# EasyEDA Pro project ProPrj_Inverted_MAML_6x6_2026-07-03.epro

# Schematic MUL_CELL_2X_2T1C_1
Create Date: 2026-06-07; Page Name: P1; Project Name: Inverted_MAML_6x6; Schematic Name: Schematic2; Update Date: 2026-06-07; Company: EasyEDA.com; Drawn: Olle Welin; Page Size: A4; Version: V1.0
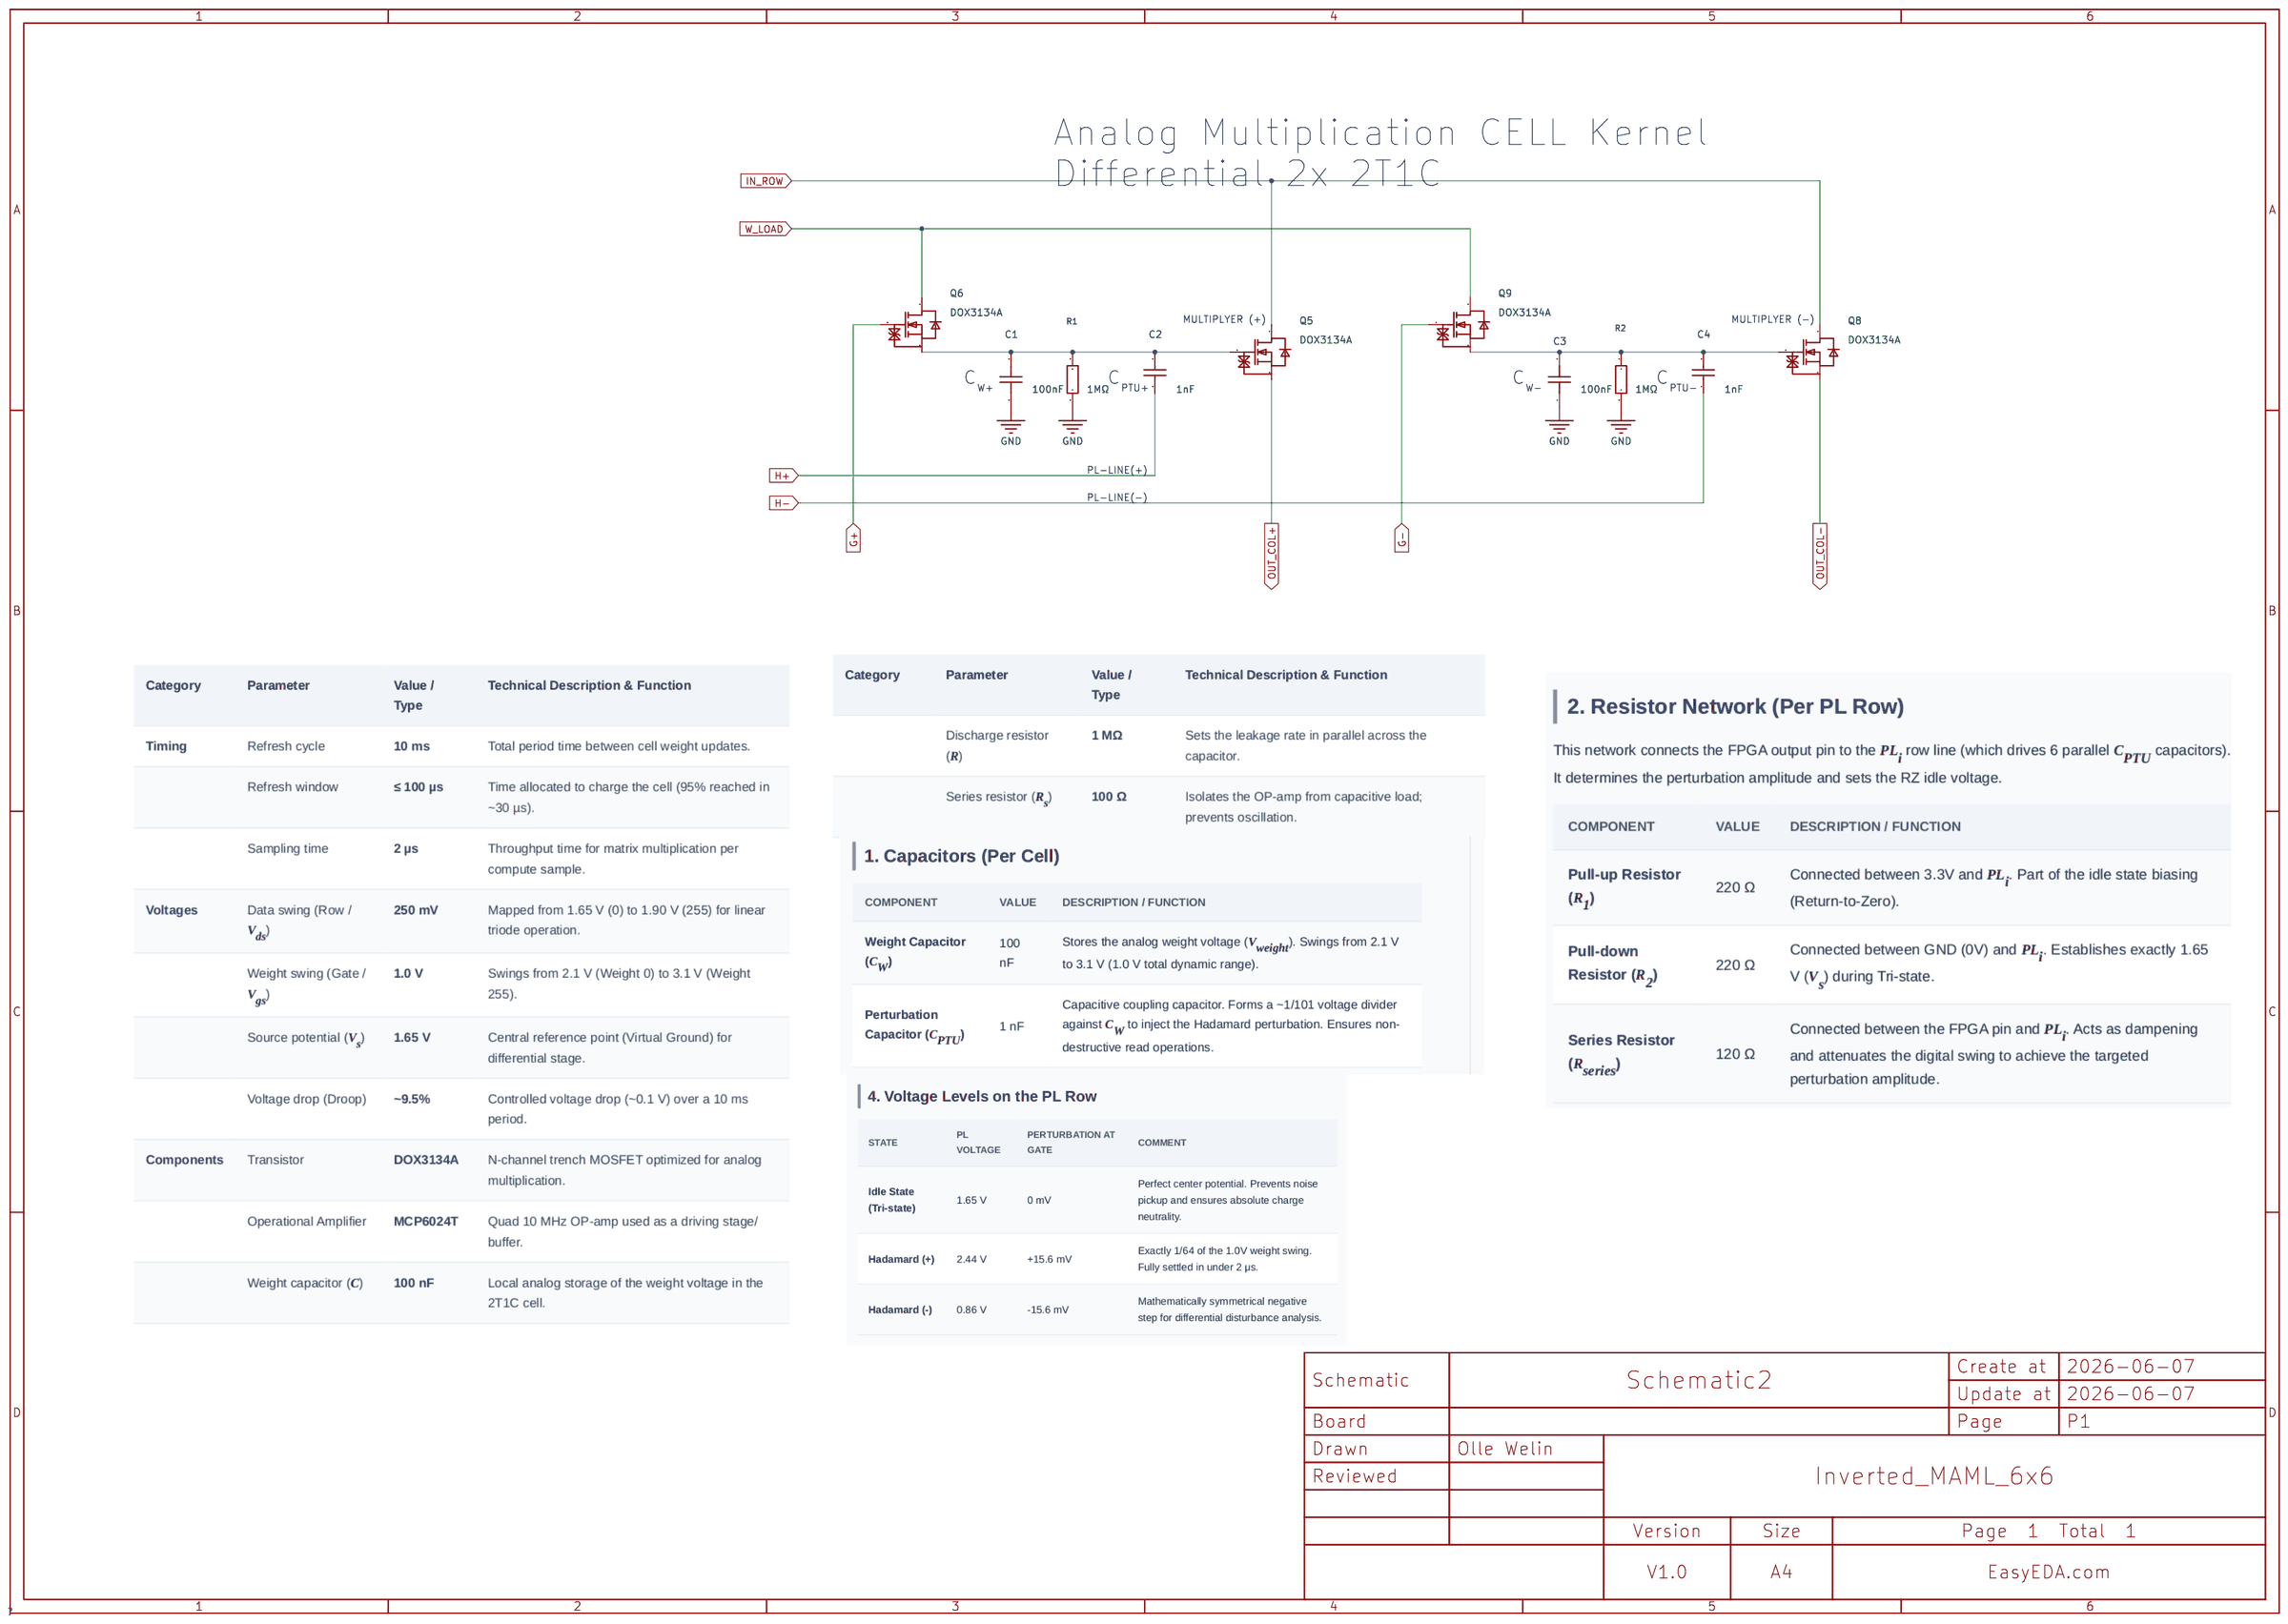
[diagram p0: schematic sheet]

## Parts
C1  100nF  [C0402]
C2  1nF  [C0402]
C3  100nF  [C0402]
C4  1nF  [C0402]
Q5  DOX3134A  [SOT-323-3_L2.1-W1.3-P1.30-LS2.3-BR]
Q6  DOX3134A  [SOT-323-3_L2.1-W1.3-P1.30-LS2.3-BR]
Q8  DOX3134A  [SOT-323-3_L2.1-W1.3-P1.30-LS2.3-BR]
Q9  DOX3134A  [SOT-323-3_L2.1-W1.3-P1.30-LS2.3-BR]
R1  1MΩ  [R0402]
R2  1MΩ  [R0402]

## Library data of the parts
C1 C3 = CL05B104KO5NNNC: Capacitance:100nF Tolerance:±10% Tolerance:±10% Voltage Rating:16V Temperature Coefficient:X7R; LCSC Part Name: 100nF ±10% 16V; Supplier Part: C1525; Manufacturer: SAMSUNG(三星); Supplier Footprint: 0402; JLCPCB Part Class: Basic Part; Datasheet: https://item.szlcsc.com/datasheet/CL05B104KO5NNNC/1877.html; Supplier: LCSC; Tolerance: ±10%; Voltage Rating: 16V; Temperature Coefficient: X7R
C2 C4 = 0402B102K500NT: Capacitance:1nF Tolerance:±10% Tolerance:±10% Voltage Rating:50V Temperature Coefficient:X7R; LCSC Part Name: 1nF ±10% 50V; Supplier Part: C1523; Manufacturer: FH(风华); Supplier Footprint: 0402; JLCPCB Part Class: Basic Part; Datasheet: https://item.szlcsc.com/datasheet/0402B102K500NT/1875.html; Supplier: LCSC; Tolerance: ±10%; Voltage Rating: 50V; Temperature Coefficient: X7R
Q5 Q6 Q8 Q9 = DOX3134A: Number:1 N-channel Drain to Source Voltage:20V Current - Continuous Drain(Id):900mA RDS(on):120Ω@4.5V Pd - Power Dissipation:220mW Gate Threshold Voltage (Vgs(th)):600mV Gate Charge(Qg):1nC@4.5V Input Capacitance(Ciss):63pF Reverse Transfer Capacitance (C; Supplier Part: C54349756; Manufacturer: DOINGTER(杜因特); Supplier Footprint: SOT-323; JLCPCB Part Class: Extended Part; Datasheet: https://item.szlcsc.com/datasheet/DOX3134A/57652932.html; Supplier: LCSC; Number: 1 N-channel; Drain to Source Voltage: 20V; Current - Continuous Drain(Id): 900mA; RDS(on): 120Ω@4.5V; Pd - Power Dissipation: 220mW; Gate Threshold Voltage (Vgs(th)): 600mV; Gate Charge(Qg): 1nC@4.5V; Input Capacitance(Ciss): 63pF; Reverse Transfer Capacitance (Crss@Vds): 12pF; Operating Temperature: -50℃~+150℃; Type: N-Channel; Output Capacitance(Coss): 23pF
R1 R2 = 0402WGF1004TCE: Type:Thick Film Resistor Resistance:1MΩ Tolerance:±1% Tolerance:±1% Power(Watts):62.5mW Voltage-Supply(Max):50V Temperature Coefficient:±100ppm/℃ Temperature Coefficient:±100ppm/℃ Operating Temperature:-55℃~+155℃ Operating Temperature:-55℃~+155℃; LCSC Part Name: 1MΩ ±1% 62.5mW 厚膜电阻; Supplier Part: C26083; Manufacturer: UNI-ROYAL(厚声); Supplier Footprint: 0402; JLCPCB Part Class: Basic Part; Datasheet: https://item.szlcsc.com/datasheet/0402WGF1004TCE/26826.html; Supplier: LCSC; Type: Thick Film Resistor; Tolerance: ±1%; Power(Watts): 62.5mW; Voltage-Supply(Max): 50V; Temperature Coefficient: ±100ppm/℃; Operating Temperature: -55℃~+155℃

## Nets
GND: C1.1 C3.1 R1.1 R2.1
G+: Q6.1(G)
G-: Q9.1(G)
H+: C2.1
H-: C4.1
IN_ROW: Q5.3(D) Q8.3(D)
OUT_COL+: Q5.2(S)
OUT_COL-: Q8.2(S)
W_LOAD: Q6.3(D) Q9.3(D)
Net-(C1-2): C1.2 C2.2 Q5.1(G) Q6.2(S) R1.2
Net-(C3-2): C3.2 C4.2 Q8.1(G) Q9.2(S) R2.2

## Notes on the sheet
- Analog Multiplication CELL Kernel
  Differential 2x 2T1C
- MULTIPLYER (+)
- MULTIPLYER (-)
- C
- C
- C
- C
- W+
- PTU+
- W-
- PTU-
- PL-LINE(+)
- PL-LINE(-)

# Schematic fpga_t120_etc2
Create Date: 2025-12-23; Page Name: P1; Project Name: FPGA_motors_V3_0_4; Schematic Name: fpga_t120_etc2; Update Date: 2025-12-23; Company: EasyEDA.com; Page Size: A4; Version: V1.0
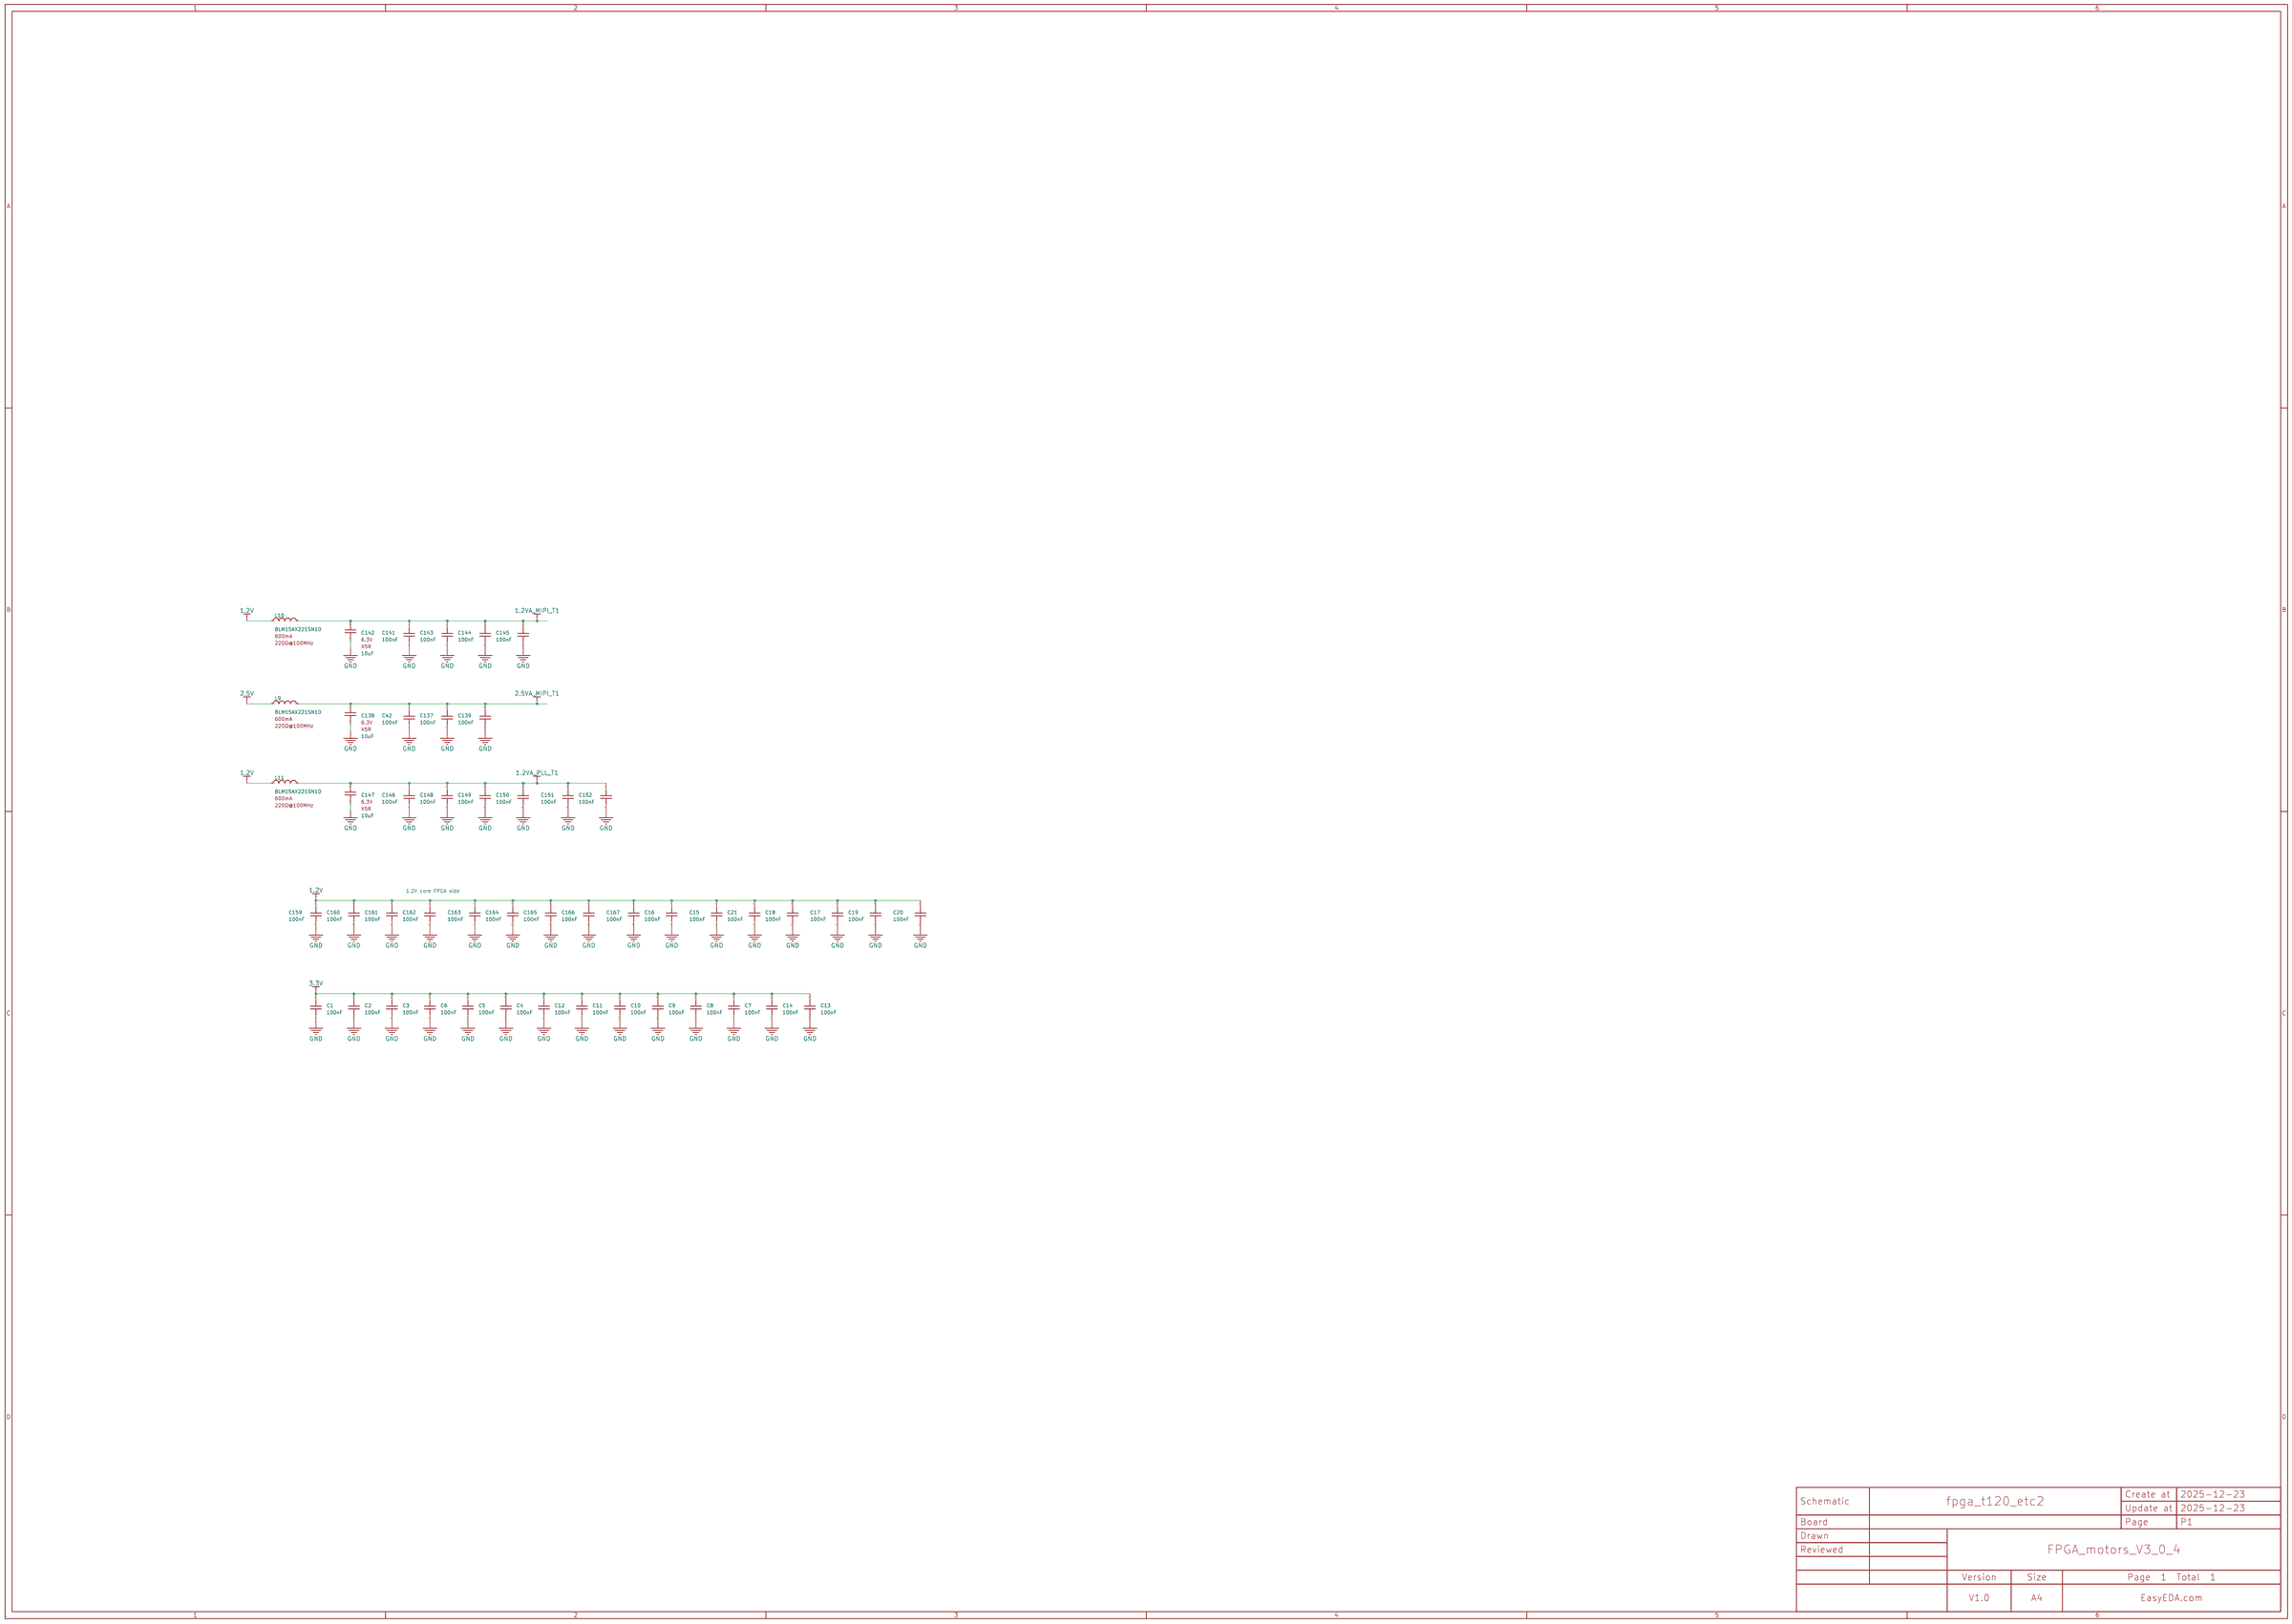
[diagram p1: schematic sheet]

## Parts
C1  100nF  [C0201]
C2  100nF  [C0201]
C3  100nF  [C0201]
C4  100nF  [C0201]
C5  100nF  [C0201]
C6  100nF  [C0201]
C7  100nF  [C0201]
C8  100nF  [C0201]
C9  100nF  [C0201]
C10  100nF  [C0201]
C11  100nF  [C0201]
C12  100nF  [C0201]
C13  100nF  [C0201]
C14  100nF  [C0201]
C15  100nF  [C0402]
C16  100nF  [C0402]
C17  100nF  [C0402]
C18  100nF  [C0402]
C19  100nF  [C0402]
C20  100nF  [C0402]
C21  100nF  [C0402]
C42  100nF  [C0402]
C137  100nF  [C0402]
C138  10uF  [C0402]
C139  100nF  [C0402]
C141  100nF  [C0402]
C142  10uF  [C0402]
C143  100nF  [C0402]
C144  100nF  [C0402]
C145  100nF  [C0402]
C146  100nF  [C0402]
C147  10uF  [C0402]
C148  100nF  [C0402]
C149  100nF  [C0402]
C150  100nF  [C0402]
C151  100nF  [C0402]
C152  100nF  [C0402]
C159  100nF  [C0402]
C160  100nF  [C0402]
C161  100nF  [C0402]
C162  100nF  [C0402]
C163  100nF  [C0402]
C164  100nF  [C0402]
C165  100nF  [C0402]
C166  100nF  [C0402]
C167  100nF  [C0402]
L9  BLM15AX221SN1D  [L0402]
L10  BLM15AX221SN1D  [L0402]
L11  BLM15AX221SN1D  [L0402]

## Library data of the parts
C1-C14 = CL03A104KP3NNNC: Capacitance:100nF Tolerance:±10% Tolerance:±10% Voltage Rating:10V Temperature Coefficient:X5R; LCSC Part Name: 100nF ±10% 10V; Supplier Part: C49062; Manufacturer: SAMSUNG(三星); Supplier Footprint: 0201; JLCPCB Part Class: Extended Part; Datasheet: https://item.szlcsc.com/datasheet/CL03A104KP3NNNC/50070.html; Supplier: LCSC; Tolerance: ±10%; Voltage Rating: 10V; Temperature Coefficient: X5R
C15-C21 C42 C137 C139 C141 C143-C146 C148-C152 C159-C167 = CL05B104KB54PNC: Capacitance: Tolerance:±10% Tolerance:±10% Voltage Rated: Temperature Coefficient:; LCSC Part Name: 100nF ±10% 50V; Supplier Part: C307331; Manufacturer: SAMSUNG(三星); Supplier Footprint: 0402; JLCPCB Part Class: Basic Part; Datasheet: https://atta.szlcsc.com/upload/public/pdf/source/20160218/1457707763339.pdf; Supplier: LCSC; Tolerance: ±10%
C138 C142 C147 = CL05A106MQ5NUNC: Capacitance:10uF Tolerance:±20% Tolerance:±20% Voltage Rating:6.3V Temperature Coefficient:X5R; LCSC Part Name: 10uF ±20% 6.3V; Supplier Part: C15525; Manufacturer: SAMSUNG(三星); Supplier Footprint: 0402; JLCPCB Part Class: Basic Part; Datasheet: https://item.szlcsc.com/datasheet/CL05A106MQ5NUNC/16204.html; Supplier: LCSC; Tolerance: ±20%; Voltage Rating: 6.3V; Temperature Coefficient: X5R
L9-L11 = BLM15AX221SN1D: Impedance @ Frequency:220Ω@100MHz Tolerance:±25% Tolerance:±25% DC Resistance(DCR):180mΩ Current Rating:600mA Number of Circuits:1 Operating Temperature:-55℃~+125℃ Operating Temperature:-55℃~+125℃; LCSC Part Name: 单路 0402磁珠 阻抗220Ω@100MHz; Supplier Part: C76885; Manufacturer: muRata(村田); Supplier Footprint: 0402; JLCPCB Part Class: Extended Part; Datasheet: https://item.szlcsc.com/datasheet/BLM15AX221SN1D/78012.html; Supplier: LCSC; Impedance @ Frequency: 220Ω@100MHz; Tolerance: ±25%; DC Resistance(DCR): 180mΩ; Current Rating: 600mA; Number of Circuits: 1; Operating Temperature: -55℃~+125℃

## Nets
1.2V: C15.1 C16.1 C17.1 C18.1 C19.1 C20.1 C21.1 C159.1 C160.1 C161.1 C162.1 C163.1 C164.1 C165.1 C166.1 C167.1 L10.1 L11.1
1.2VA_MIPI_T1: C141.1 C142.2 C143.1 C144.1 C145.1 L10.2
1.2VA_PLL_T1: C146.1 C147.2 C148.1 C149.1 C150.1 C151.1 C152.1 L11.2
2.5V: L9.1
2.5VA_MIPI_T1: C42.1 C137.1 C138.2 C139.1 L9.2
3.3V: C1.2 C2.2 C3.2 C4.2 C5.2 C6.2 C7.2 C8.2 C9.2 C10.2 C11.2 C12.2 C13.2 C14.2
GND: C1.1 C2.1 C3.1 C4.1 C5.1 C6.1 C7.1 C8.1 C9.1 C10.1 C11.1 C12.1 C13.1 C14.1 C15.2 C16.2 C17.2 C18.2 C19.2 C20.2 C21.2 C42.2 C137.2 C138.1 C139.2 C141.2 C142.1 C143.2 C144.2 C145.2 C146.2 C147.1 C148.2 C149.2 C150.2 C151.2 C152.2 C159.2 C160.2 C161.2 C162.2 C163.2 C164.2 C165.2 C166.2 C167.2

## Notes on the sheet
- 1.2V core FPGA side

# Schematic ETH_PHY
Create Date: 2025-12-23; Page Name: P1; Project Name: FPGA_motors_V3_0_4; Schematic Name: ETH_PHY; Update Date: 2025-12-23; Company: EasyEDA.com; Page Size: A4; Version: V1.0
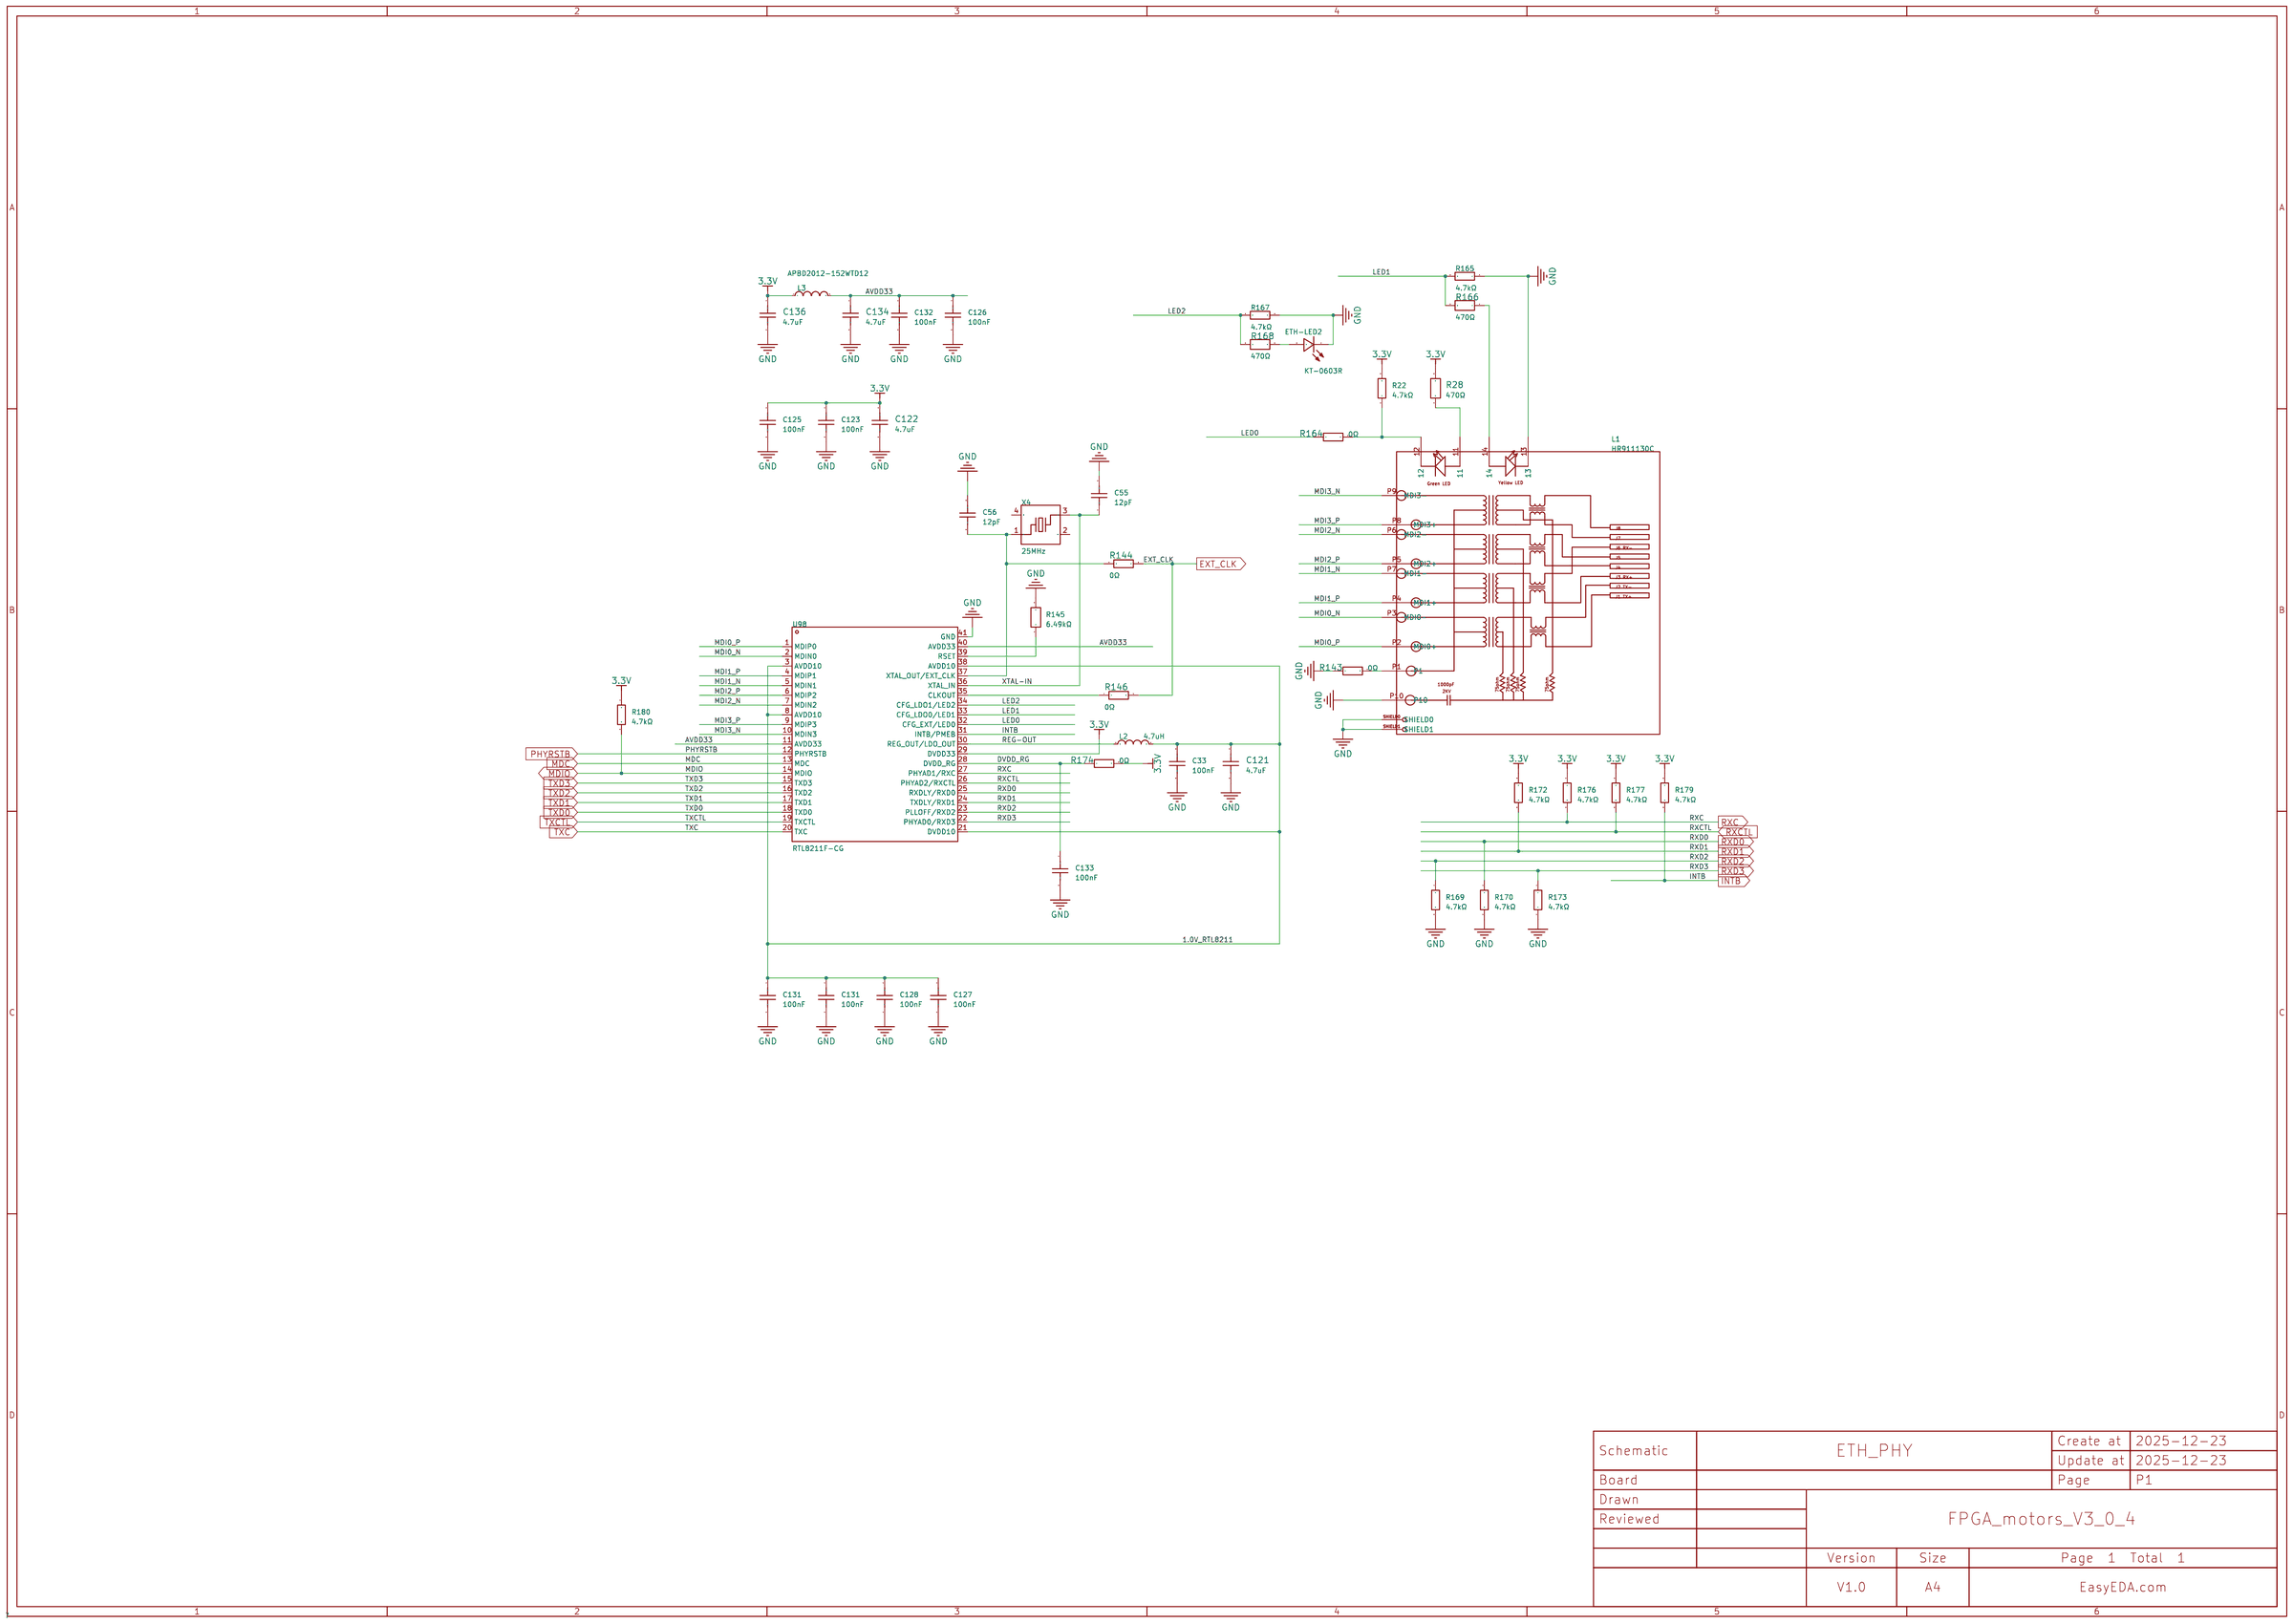
[diagram p2: schematic sheet]

## Parts
C33  100nF  [C0402]
C55  12pF  [C0402]
C56  12pF  [C0402]
C121  4.7uF  [C0402]
C122  4.7uF  [C0402]
C123  100nF  [C0402]
C125  100nF  [C0402]
C126  100nF  [C0402]
C127  100nF  [C0402]
C128  100nF  [C0402]
C131  100nF  [C0402]
C131#2  100nF  [C0402]
C132  100nF  [C0402]
C133  100nF  [C0402]
C134  4.7uF  [C0402]
C136  4.7uF  [C0402]
ETH-LED2  KT-0603R  [LED0603-RD]
L1  HR911130C  [RJ45-TH_HR911130C]
L2  4.7uH  [IND-SMD_L7.8-W7.0_SUMIDA_CD73]
L3  APBD2012-152WTD12  [L0805]
R22  4.7kΩ  [R0402]
R28  470Ω  [R0402]
R143  0Ω  [R0402]
R144  0Ω  [R0402]  (no BOM)
R145  6.49kΩ  [R0402]
R146  0Ω  [R0402]  (no BOM)
R164  0Ω  [R0402]
R165  4.7kΩ  [R0402]
R166  470Ω  [R0402]
R167  4.7kΩ  [R0402]
R168  470Ω  [R0402]
R169  4.7kΩ  [R0402]
R170  4.7kΩ  [R0402]  (no BOM)
R172  4.7kΩ  [R0402]  (no BOM)
R173  4.7kΩ  [R0402]  (no BOM)
R174  0Ω  [R0402]
R176  4.7kΩ  [R0402]  (no BOM)
R177  4.7kΩ  [R0402]  (no BOM)
R179  4.7kΩ  [R0402]
R180  4.7kΩ  [R0402]
U98  RTL8211F-CG  [WQFN-40_L5.0-W5.0-P0.4-BL-EP]
X4  25MHz  [CRYSTAL-SMD_4P-L5.0-W3.2-BL]

## Library data of the parts
C33 C123 C125-C128 C131 C131#2 C132 C133 = CL05B104KB54PNC: Capacitance: Tolerance:±10% Tolerance:±10% Voltage Rated: Temperature Coefficient:; LCSC Part Name: 100nF ±10% 50V; Supplier Part: C307331; Manufacturer: SAMSUNG(三星); Supplier Footprint: 0402; JLCPCB Part Class: Basic Part; Datasheet: https://atta.szlcsc.com/upload/public/pdf/source/20160218/1457707763339.pdf; Supplier: LCSC; Tolerance: ±10%; Check: true
C55 C56 = V120J0402HQC500NBT: Capacitance:12pF Voltage Rating:50V Temperature Coefficient:C0G; LCSC Part Name: ±5pF 12pF 50V; Supplier Part: C5251212; Manufacturer: VIIYONG(微容); Supplier Footprint: 0402; JLCPCB Part Class: Extended Part; Datasheet: https://atta.szlcsc.com/upload/public/pdf/source/20210621/C2841456_D184B2C3CE76695828CADF567D00C122.pdf; Supplier: LCSC; Voltage Rating: 50V; Temperature Coefficient: C0G; Check: true
C121 C122 C134 C136 = LMK105BBJ475MVLF: Capacitance: Tolerance:±20% Tolerance:±20% Voltage Rated: Temperature Coefficient:; LCSC Part Name: 4.7uF ±20% 10V; Supplier Part: C23733; Manufacturer: TAIYO YUDEN(太诱); Supplier Footprint: 0402; JLCPCB Part Class: Extended Part; Datasheet: https://atta.szlcsc.com/upload/public/pdf/source/20210525/C2802164_C0429B055888A674C3F00BA74B841C5B.pdf; Supplier: LCSC; Tolerance: ±20%; Check: true
ETH-LED2 = KT-0603R: Emitted Color:Red Power Dissipation:- Forward Current:- Dominant Wavelength:- Dominant Wavelength:- Peak Wavelength:- Diode Configuration:- Lens Color:- Color Temperature:- Color Temperature:- Viewing Angle:- Mounting Sytle:- Operating Temperature:-40℃~+8; LCSC Part Name: 0603 红灯 高亮; Supplier Part: C2286; Manufacturer: KENTO; Supplier Footprint: 0603; JLCPCB Part Class: Basic Part; Datasheet: https://atta.szlcsc.com/upload/public/pdf/source/20160616/1466072038404.pdf; Supplier: LCSC; Emitted Color: Red; Operating Temperature: -40℃~+85℃
L1 = HR911130C: Connector Type:RJ45 Jack Mounting Type:Right Angle Number of Ports:1 LED:With LED Shielding:Shielded Ratings:- Operating Temperature:- Operating Temperature:-; LCSC Part Name: 弯插 带LED; Supplier Part: C50933; Manufacturer: HANRUN(汉仁); Supplier Footprint: 插件; JLCPCB Part Class: Extended Part; Datasheet: https://item.szlcsc.com/datasheet/HR911130C/51945.html; Supplier: LCSC; Connector Type: RJ45 Jack; Mounting Type: Right Angle; Number of Ports: 1; LED: With LED; Shielding: Shielded
L2 = FCD75-4R7M: Inductance:4.7uH Tolerance:±20% Tolerance:±20% Current - Saturation(Isat):4.2A DC Resistance(DCR):30mΩ Type:-; LCSC Part Name: SMD,7.8*7.0*5.0mm(0705)CD电感; Supplier Part: C41382395; Manufacturer: cjiang(长江微电); Supplier Footprint: SMD,7.8x7mm; Datasheet: https://atta.szlcsc.com/upload/public/pdf/source/20240910/39AFF787A42FA6B55710C93C1E169A83.pdf; Supplier: LCSC; Tolerance: ±20%; Current - Saturation(Isat): 4.2A; DC Resistance(DCR): 30mΩ
L3 = APBD2012-152WTD12: Impedance @ Frequency:1.5kΩ@100MHz Tolerance:±25% Tolerance:±25% DC Resistance(DCR):400mΩ Current Rating:550mA Operating Temperature:-55℃~+125℃ Operating Temperature:-55℃~+125℃; Supplier Part: C50325953; Manufacturer: APV(爱普微); Supplier Footprint: 0805; JLCPCB Part Class: Extended Part; Datasheet: https://item.szlcsc.com/datasheet/APBD2012-152WTD12/52921127.html; Supplier: LCSC; Impedance @ Frequency: 1.5kΩ@100MHz; Tolerance: ±25%; DC Resistance(DCR): 400mΩ; Current Rating: 550mA; Operating Temperature: -55℃~+125℃
R22 R165 R167 R169 R170 R172 R173 R176 R177 R179 R180 = 0402WGF4701TCE: Type:Thick Film Resistors Resistance:4.7kΩ Tolerance:±1% Tolerance:±1% Power(Watts): Overload Voltage (Max): Temperature Coefficient:±100ppm/℃ Temperature Coefficient:±100ppm/℃ Operating Temperature Range:-55℃~+155℃ Operating Temperature Range:-55℃~+155℃; LCSC Part Name: 4.7kΩ ±1% 62.5mW 厚膜电阻; Supplier Part: C25900; Manufacturer: UNI-ROYAL(厚声); Supplier Footprint: 0402; JLCPCB Part Class: Basic Part; Datasheet: https://item.szlcsc.com/datasheet/0402WGF4701TCE/26643.html; Supplier: LCSC; Type: Thick Film Resistor; Tolerance: ±1%; Power(Watts): 62.5mW; Voltage-Supply(Max): 50V; Temperature Coefficient: ±100ppm/℃; Operating Temperature: -55℃~+155℃
R28 R166 R168 = 0402WGF4700TCE: Type:Thick Film Resistors Resistance: Tolerance:±1% Tolerance:±1% Power(Watts): Overload Voltage (Max): Temperature Coefficient:±100ppm/℃ Temperature Coefficient:±100ppm/℃ Operating Temperature Range:-55℃~+155℃ Operating Temperature Range:-55℃~+155℃; LCSC Part Name: 470Ω ±1% 62.5mW 厚膜电阻; Supplier Part: C25117; Manufacturer: UNI-ROYAL(厚声); Supplier Footprint: 0402; JLCPCB Part Class: Basic Part; Datasheet: https://atta.szlcsc.com/upload/public/pdf/source/20200306/C422600_1E6D84923E4A46A82E41ADD87F860B5C.pdf; Supplier: LCSC; Type: Thick Film Resistors; Tolerance: ±1%; Temperature Coefficient: ±100ppm/℃; Operating Temperature Range: -55℃~+155℃
R143 R144 R146 R164 R174 = 0402WGF0000TCE: Type:Thick Film Resistor Resistance:0Ω Tolerance:±1% Tolerance:±1% Power(Watts):62.5mW Voltage-Supply(Max):50V Temperature Coefficient:±800ppm/℃ Temperature Coefficient:±800ppm/℃ Operating Temperature:-55℃~+155℃ Operating Temperature:-55℃~+155℃; LCSC Part Name: 0Ω ±1% 62.5mW 厚膜电阻; Supplier Part: C17168; Manufacturer: UNI-ROYAL(厚声); Supplier Footprint: 0402; JLCPCB Part Class: Basic Part; Datasheet: https://item.szlcsc.com/datasheet/0402WGF0000TCE/17853.html; Supplier: LCSC; Type: Thick Film Resistor; Tolerance: ±1%; Power(Watts): 62.5mW; Voltage-Supply(Max): 50V; Temperature Coefficient: ±800ppm/℃; Operating Temperature: -55℃~+155℃
R145 = RT0402BRE076K49L: Type:Thin Film Resistor Resistance: Tolerance:±0.1% Tolerance:±0.1% Power(Watts): Temperature Coefficient:±50ppm/℃ Temperature Coefficient:±50ppm/℃ Operating Temperature Range:-55℃~+155℃ Operating Temperature Range:-55℃~+155℃; LCSC Part Name: 薄膜电阻 6.49kΩ ±0.1% 62.5mW; Supplier Part: C853380; Manufacturer: YAGEO(国巨); Supplier Footprint: 0402; JLCPCB Part Class: Extended Part; Datasheet: https://atta.szlcsc.com/upload/public/pdf/source/20200610/C326738_5639A9F1B6EB6E4AE2197577D3456E7F.pdf; Supplier: LCSC; Type: Thin Film Resistor; Tolerance: ±0.1%; Temperature Coefficient: ±50ppm/℃; Operating Temperature Range: -55℃~+155℃
U98 = RTL8211F-CG: Applications Function:- Number of Channels:- MAC Interface:RGMII Voltage - Supply:1.8V；2.5V；3.3V；1.5V Voltage - Supply:1.8V；2.5V；3.3V；1.5V; LCSC Part Name: 集成10/100/1000M以太网精密收发器; Supplier Part: C187932; Manufacturer: REALTEK(瑞昱); Supplier Footprint: WQFN-40-EP(5x5); JLCPCB Part Class: Extended Part; Datasheet: https://item.szlcsc.com/datasheet/RTL8211F-CG/199338.html; Supplier: LCSC; MAC Interface: RGMII; Voltage - Supply: 1.8V；2.5V；3.3V；1.5V
X4 = XC53M4-25.000-F12JJDT: Type:Surface Mount Crystal Frequency:25MHz Normal temperature Frequency Tolerance:±30ppm Normal temperature Frequency Tolerance:±30ppm Load Capacitance:12pF Frequency Stability:±30ppm Frequency Stability:±30ppm Equivalent Series Resistance(ESR):50Ω Operat; LCSC Part Name: 25MHz ±30ppm 12pF; Supplier Part: C2916916; Manufacturer: HCI(杭晶); Supplier Footprint: SMD5032-4P; JLCPCB Part Class: Extended Part; Datasheet: https://atta.szlcsc.com/upload/public/pdf/source/20220525/EE70191DC8EBB19615A77EA6B0DDD31A.pdf; Supplier: LCSC; Type: Surface Mount Crystal; Normal temperature Frequency Tolerance: ±30ppm; Load Capacitance: 12pF; Frequency Stability: ±30ppm; Equivalent Series Resistance(ESR): 50Ω

## Nets
1.0V_RTL8211: C33.1 C121.1 C127.1 C128.1 C131.1 C131#2.1 L2.2 U98.3(AVDD10) U98.8(AVDD10) U98.21(DVDD10) U98.38(AVDD10)
3.3V: C122.1 C123.1 C125.1 C136.1 L3.1 R22.2 R28.2 R172.1 R174.2 R176.1 R177.1 R179.1 R180.1 U98.29(DVDD33)
AVDD33: C126.1 C132.1 C134.1 L3.2 U98.11(AVDD33) U98.40(AVDD33)
DVDD_RG: C133.1 R174.1 U98.28(DVDD_RG)
GND: C33.2 C55.2 C56.2 C121.2 C122.2 C123.2 C125.2 C126.2 C127.2 C128.2 C131.2 C131#2.2 C132.2 C133.2 C134.2 C136.2 ETH-LED2.1(K) L1.13 L1.P10 L1.SHIELD0 L1.SHIELD1 R143.1 R145.2 R165.1 R167.1 R169.2 R170.2 R173.2 U98.41(GND)
EXT_CLK: R144.2 R146.2
INTB: R179.2 U98.31(INTB/PMEB)
LED0: R164.1 U98.32(CFG_EXT/LED0)
LED1: R165.2 R166.2 U98.33(CFG_LDO0/LED1)
LED2: R167.2 R168.2 U98.34(CFG_LDO1/LED2)
MDC: U98.13(MDC)
MDI0_N: L1.P3(MDI0-) U98.2(MDIN0)
MDI0_P: L1.P2(MDI0+) U98.1(MDIP0)
MDI1_N: L1.P7(MDI1-) U98.5(MDIN1)
MDI1_P: L1.P4(MDI1+) U98.4(MDIP1)
MDI2_N: L1.P6(MDI2-) U98.7(MDIN2)
MDI2_P: L1.P5(MDI2+) U98.6(MDIP2)
MDI3_N: L1.P9(MDI3-) U98.10(MDIN3)
MDI3_P: L1.P8(MDI3+) U98.9(MDIP3)
MDIO: R180.2 U98.14(MDIO)
PHYRSTB: U98.12(PHYRSTB)
REG-OUT: L2.1 U98.30(REG_OUT/LDO_OUT)
RXC: R176.2 U98.27(PHYAD1/RXC)
RXCTL: R177.2 U98.26(PHYAD2/RXCTL)
RXD0: R170.1 U98.25(RXDLY/RXD0)
RXD1: R172.2 U98.24(TXDLY/RXD1)
RXD2: R169.1 U98.23(PLLOFF/RXD2)
RXD3: R173.1 U98.22(PHYAD0/RXD3)
TXC: U98.20(TXC)
TXCTL: U98.19(TXCTL)
TXD0: U98.18(TXD0)
TXD1: U98.17(TXD1)
TXD2: U98.16(TXD2)
TXD3: U98.15(TXD3)
XTAL-IN: C55.1 U98.36(XTAL_IN) X4.3
Net-(C56-1): C56.1 R144.1 U98.37(XTAL_OUT/EXT_CLK) X4.1
Net-(ETH-LED2-2): ETH-LED2.2(A) R168.1
Net-(L1-11): L1.11 R28.1
Net-(L1-12): L1.12 R22.1 R164.2
Net-(L1-14): L1.14 R166.1
Net-(L1-P1): L1.P1 R143.2
Net-(R145-1): R145.1 U98.39(RSET)
Net-(R146-1): R146.1 U98.35(CLKOUT)

Not connected (* = marked no-connect by the designer): X4 2(GND) 4(GND)

# Schematic FT2232_a
Create Date: 2025-11-25; Page Name: P1; Project Name: FPGA_motors_V3_0; Schematic Name: FT2232_a; Update Date: 2025-11-25; Company: EasyEDA.com; Page Size: A4; Version: V1.0
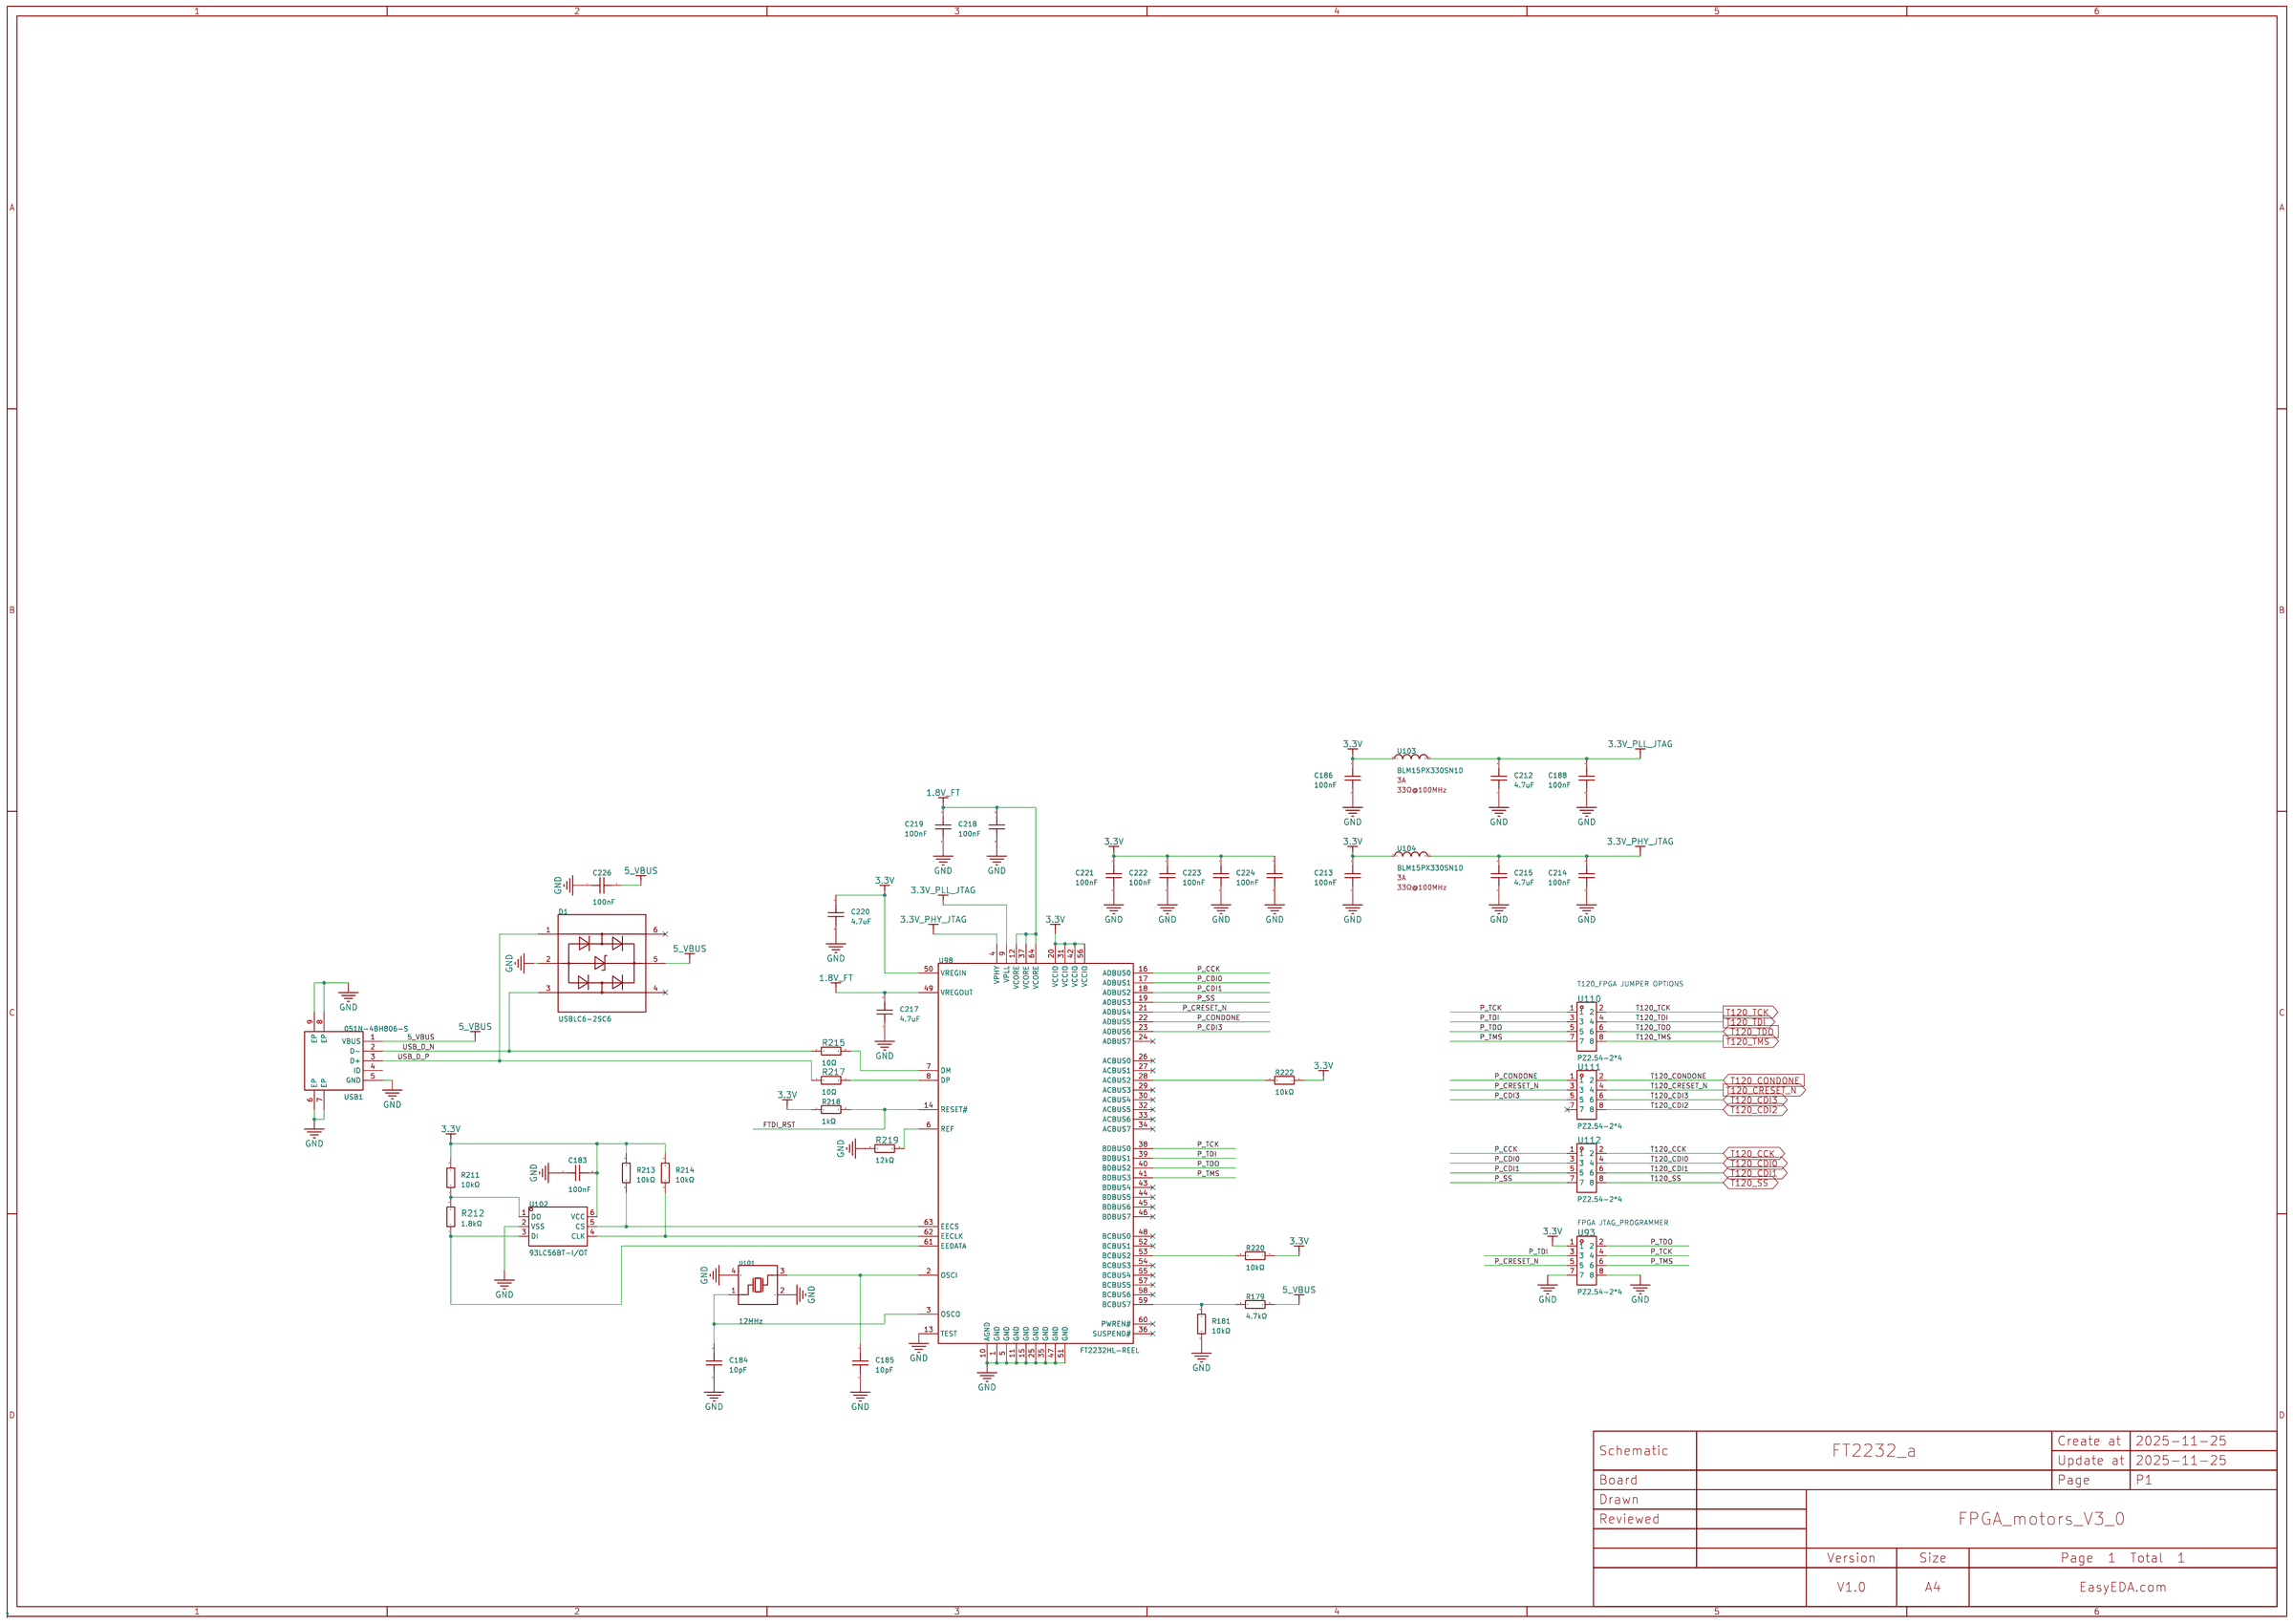
[diagram p3: schematic sheet]

## Parts
C183  100nF  [C0402]  (no BOM)
C184  10pF  [C0402]
C185  10pF  [C0402]
C186  100nF  [C0402]
C188  100nF  [C0402]
C212  4.7uF  [C0402]
C213  100nF  [C0402]
C214  100nF  [C0402]
C215  4.7uF  [C0402]
C217  4.7uF  [C0402]
C218  100nF  [C0402]
C219  100nF  [C0402]
C220  4.7uF  [C0402]
C221  100nF  [C0402]
C222  100nF  [C0402]
C223  100nF  [C0402]
C224  100nF  [C0402]
C226  100nF  [C0402]  (no BOM)
D1  USBLC6-2SC6  [SOT-23-6_L2.9-W1.6-P0.95-LS2.8-BL]
R179  4.7kΩ  [R0402]
R181  10kΩ  [R0402]
R211  10kΩ  [R0402]
R212  1.8kΩ  [R0402]
R213  10kΩ  [R0402]
R214  10kΩ  [R0402]
R215  10Ω  [R0402]
R217  10Ω  [R0402]
R218  1kΩ  [R0402]
R219  12kΩ  [R0402]
R220  10kΩ  [R0402]
R222  10kΩ  [R0402]
U93  PZ2.54-2*4  [HDR-TH_8P-P2.54-V-M-R2-C4-S2.54]
U98  FT2232HL-REEL  [LQFP-64_L10.0-W10.0-P0.50-LS12.0-TL]
U101  12MHz  [CRYSTAL-SMD_4P-L3.2-W2.5-BL]
U102  93LC56BT-I/OT  [SOT-23-6_L2.9-W1.6-P0.95-LS2.8-BR]  (no BOM)
U103  BLM15PX330SN1D  [L0402]
U104  BLM15PX330SN1D  [L0402]
U110  PZ2.54-2*4  [HDR-TH_8P-P2.54-V-M-R2-C4-S2.54]
U111  PZ2.54-2*4  [HDR-TH_8P-P2.54-V-M-R2-C4-S2.54]
U112  PZ2.54-2*4  [HDR-TH_8P-P2.54-V-M-R2-C4-S2.54]
USB1  051N-4BH806-S  [MICRO-USB-SMD_051N-4BH806-S]

## Library data of the parts
C183 C186 C188 C213 C214 C218 C219 C221-C224 C226 = CL05B104KB54PNC: Capacitance: Tolerance:±10% Tolerance:±10% Voltage Rated: Temperature Coefficient:; LCSC Part Name: 100nF ±10% 50V; Supplier Part: C307331; Manufacturer: SAMSUNG(三星); Supplier Footprint: 0402; JLCPCB Part Class: Basic Part; Datasheet: https://atta.szlcsc.com/upload/public/pdf/source/20160218/1457707763339.pdf; Supplier: LCSC; Tolerance: ±10%; Check: true
C184 C185 = CL05C100JB5NNNC: Capacitance:10pF Tolerance:±5% Tolerance:±5% Voltage Rating:50V Temperature Coefficient:C0G; LCSC Part Name: 10pF ±5% 50V; Supplier Part: C32949; Manufacturer: SAMSUNG(三星); Supplier Footprint: 0402; JLCPCB Part Class: Basic Part; Datasheet: https://item.szlcsc.com/datasheet/CL05C100JB5NNNC/33914.html; Supplier: LCSC; Tolerance: ±5%; Voltage Rating: 50V; Temperature Coefficient: C0G
C212 C215 C217 C220 = CL05A475MP5NRNC: Capacitance:4.7uF Tolerance:±20% Tolerance:±20% Voltage Rating:10V Temperature Coefficient:X5R; LCSC Part Name: 4.7uF ±20% 10V; Supplier Part: C23733; Manufacturer: SAMSUNG(三星); Supplier Footprint: 0402; JLCPCB Part Class: Basic Part; Datasheet: https://item.szlcsc.com/datasheet/CL05A475MP5NRNC/24469.html; Supplier: LCSC; Tolerance: ±20%; Temperature Coefficient: X5R; Voltage Rating: 10V
D1 = USBLC6-2SC6_C7519: Polarity:Unidirectional Reverse Stand-Off Voltage (Vrwm):5.25V Clamping Voltage:17V Peak Pulse Current (Ipp):5A Voltage - Breakdown:6V Reverse Leakage Current (Ir):150nA Number of Channels:2 Operating Temperature:-40℃~+125℃ Operating Temperature:-40℃~+125; LCSC Part Name: 单向ESD; Supplier Part: C7519; Manufacturer: ST(意法半导体); Supplier Footprint: SOT-23-6L; JLCPCB Part Class: Extended Part; Datasheet: https://item.szlcsc.com/datasheet/USBLC6-2SC6/7996.html; Supplier: LCSC; Polarity: Unidirectional; Reverse Stand-Off Voltage (Vrwm): 5.25V; Clamping Voltage: 17V; Peak Pulse Current (Ipp): 5A; Voltage - Breakdown: 6V; Reverse Leakage Current (Ir): 150nA; Number of Channels: 2; Operating Temperature: -40℃~+125℃; level of protection: IEC 61000-4-2; Type: ESD; Junction Capacitance: 3.5pF
R179 = 0402WGF4701TCE: Type:Thick Film Resistors Resistance:4.7kΩ Tolerance:±1% Tolerance:±1% Power(Watts): Overload Voltage (Max): Temperature Coefficient:±100ppm/℃ Temperature Coefficient:±100ppm/℃ Operating Temperature Range:-55℃~+155℃ Operating Temperature Range:-55℃~+155℃; LCSC Part Name: 4.7kΩ ±1% 62.5mW 厚膜电阻; Supplier Part: C25900; Manufacturer: UNI-ROYAL(厚声); Supplier Footprint: 0402; JLCPCB Part Class: Basic Part; Datasheet: https://item.szlcsc.com/datasheet/0402WGF4701TCE/26643.html; Supplier: LCSC; Type: Thick Film Resistor; Tolerance: ±1%; Power(Watts): 62.5mW; Voltage-Supply(Max): 50V; Temperature Coefficient: ±100ppm/℃; Operating Temperature: -55℃~+155℃
R181 R211 R213 R214 R220 R222 = 0402WGF1002TCE: Type:Thick Film Resistors Resistance:10kΩ Tolerance:±1% Tolerance:±1% Power(Watts): Overload Voltage (Max): Temperature Coefficient:±100ppm/℃ Temperature Coefficient:±100ppm/℃ Operating Temperature Range:-55℃~+155℃ Operating Temperature Range:-55℃~+155℃; LCSC Part Name: 10kΩ ±1% 62.5mW 厚膜电阻; Supplier Part: C25744; Manufacturer: UNI-ROYAL(厚声); Supplier Footprint: 0402; JLCPCB Part Class: Basic Part; Datasheet: https://atta.szlcsc.com/upload/public/pdf/source/20200306/C422600_1E6D84923E4A46A82E41ADD87F860B5C.pdf; Supplier: LCSC; Type: Thick Film Resistors; Tolerance: ±1%; Temperature Coefficient: ±100ppm/℃; Operating Temperature Range: -55℃~+155℃
R212 = 0402WGF1801TCE: Type:Thick Film Resistor Resistance:1.8kΩ Tolerance:±1% Tolerance:±1% Power(Watts):62.5mW Voltage-Supply(Max):50V Temperature Coefficient:±100ppm/℃ Temperature Coefficient:±100ppm/℃ Operating Temperature:-55℃~+155℃ Operating Temperature:-55℃~+155℃; LCSC Part Name: 1.8kΩ ±1% 62.5mW 厚膜电阻; Supplier Part: C25871; Manufacturer: UNI-ROYAL(厚声); Supplier Footprint: 0402; JLCPCB Part Class: Extended Part; Datasheet: https://item.szlcsc.com/datasheet/0402WGF1801TCE/26614.html; Supplier: LCSC; Type: Thick Film Resistor; Tolerance: ±1%; Power(Watts): 62.5mW; Voltage-Supply(Max): 50V; Temperature Coefficient: ±100ppm/℃; Operating Temperature: -55℃~+155℃
R215 R217 = 0402WGF100JTCE: Type:Thick Film Resistor Resistance:10Ω Tolerance:±1% Tolerance:±1% Power(Watts):62.5mW Voltage-Supply(Max):50V Temperature Coefficient:±200ppm/℃ Temperature Coefficient:±200ppm/℃ Operating Temperature:-55℃~+155℃ Operating Temperature:-55℃~+155℃; LCSC Part Name: 10Ω ±1% 62.5mW 厚膜电阻; Supplier Part: C25077; Manufacturer: UNI-ROYAL(厚声); Supplier Footprint: 0402; JLCPCB Part Class: Basic Part; Datasheet: https://item.szlcsc.com/datasheet/0402WGF100JTCE/25820.html; Supplier: LCSC; Type: Thick Film Resistor; Tolerance: ±1%; Power(Watts): 62.5mW; Voltage-Supply(Max): 50V; Temperature Coefficient: ±200ppm/℃; Operating Temperature: -55℃~+155℃
R218 = 0402WGF1001TCE: Type:Thick Film Resistor Resistance:1kΩ Tolerance:±1% Tolerance:±1% Power(Watts):62.5mW Voltage-Supply(Max):50V Temperature Coefficient:±100ppm/℃ Temperature Coefficient:±100ppm/℃ Operating Temperature:-55℃~+155℃ Operating Temperature:-55℃~+155℃; LCSC Part Name: 1kΩ ±1% 62.5mW 厚膜电阻; Supplier Part: C11702; Manufacturer: UNI-ROYAL(厚声); Supplier Footprint: 0402; JLCPCB Part Class: Basic Part; Datasheet: https://item.szlcsc.com/datasheet/0402WGF1001TCE/12256.html; Supplier: LCSC; Type: Thick Film Resistor; Tolerance: ±1%; Power(Watts): 62.5mW; Voltage-Supply(Max): 50V; Temperature Coefficient: ±100ppm/℃; Operating Temperature: -55℃~+155℃
R219 = 0402WGJ0123TCE: Type:Thick Film Resistor Resistance:12kΩ Tolerance:±5% Tolerance:±5% Power(Watts):62.5mW Voltage-Supply(Max):50V Temperature Coefficient:±100ppm/℃ Temperature Coefficient:±100ppm/℃ Operating Temperature:-55℃~+155℃ Operating Temperature:-55℃~+155℃; LCSC Part Name: 12kΩ ±5% 62.5mW 厚膜电阻; Supplier Part: C25535; Manufacturer: UNI-ROYAL(厚声); Supplier Footprint: 0402; JLCPCB Part Class: Extended Part; Datasheet: https://item.szlcsc.com/datasheet/0402WGJ0123TCE/26278.html; Supplier: LCSC; Type: Thick Film Resistor; Tolerance: ±5%; Power(Watts): 62.5mW; Voltage-Supply(Max): 50V; Temperature Coefficient: ±100ppm/℃; Operating Temperature: -55℃~+155℃
U93 U110-U112 = PZ2.54-2*4: Pin Structure:2x4P Pitch:2.54mm Number of Rows:双排 Number of Pins:8P; Supplier Part: C5156676; Manufacturer: ZHOURI(洲日); Supplier Footprint: 插件,P=2.54mm; JLCPCB Part Class: Extended Part; Datasheet: https://atta.szlcsc.com/upload/public/pdf/source/20220923/0E7A4A94740FFD503E2D73F36F92C1EA.pdf; Supplier: LCSC; Pin Structure: 2x4P; Pitch: 2.54mm; Number of Rows: 双排; Number of Pins: 8P; Check: true
U98 = FT2232HL-REEL: Applications Function:USB to UART；USB to FIFO Protocol:- Voltage - Supply:- Voltage - Supply:- Operating Temperature:-40℃~+85℃ Operating Temperature:-40℃~+85℃; LCSC Part Name: FT2232H迷你模块USB高速评估模块; Supplier Part: C27882; Manufacturer: FTDI(飞特帝亚); Supplier Footprint: LQFP-64(10x10); JLCPCB Part Class: Extended Part; Datasheet: https://item.szlcsc.com/datasheet/FT2232HL-REEL/28632.html; Supplier: LCSC; Applications Function: USB to UART；USB to FIFO; Operating Temperature: -40℃~+85℃
U101 = ECS-120-10-33B-CKM-TR: Frequency:12MHz Normal temperature Frequency Tolerance:±10ppm Normal temperature Frequency Tolerance:±10ppm External load capacitor: Frequency Stability(Full temperature range):±10ppm Frequency Stability(Full temperature range):±10ppm Equivalent Series Re; LCSC Part Name: 12MHz ±10ppm 10pF; Supplier Part: C2450718; Manufacturer: ECS; Supplier Footprint: SMD3225-4P; JLCPCB Part Class: Extended Part; Datasheet: https://atta.szlcsc.com/upload/public/pdf/source/20221101/385B7103C37C13CA6DFA158A3381826D.pdf; Supplier: LCSC; Normal temperature Frequency Tolerance: ±10ppm; Frequency Stability(Full temperature range): ±10ppm; Equivalent Series Resistance (ESR): 100Ω
U102 = 93LC56BT-I/OT: Interface Type:SPI Memory Size:2Kbit Supply Voltage:2.5V~5.5V Supply Voltage:2.5V~5.5V Write Cycle Time (Tw):6ms Data Retention - TDR (Year):200 years Write Cycle Endurance:1,000,000 Times Operating Temperature:-40℃~+85℃ Operating Temperature:-40℃~+85℃; Supplier Part: C190271; Manufacturer: MICROCHIP(美国微芯); Supplier Footprint: SOT-23-6; JLCPCB Part Class: Extended Part; Datasheet: https://atta.szlcsc.com/upload/public/pdf/source/20140724/1457707164359.pdf; Supplier: LCSC; Interface Type: SPI; Memory Size: 2Kbit; Supply Voltage: 2.5V~5.5V; Write Cycle Time (Tw): 6ms; Data Retention - TDR (Year): 200 years; Write Cycle Endurance: 1,000,000 Times; Operating Temperature: -40℃~+85℃
U103 U104 = BLM15PX330SN1D: Impedance @ Frequency:33Ω@100MHz Tolerance:±25% Tolerance:±25% DC Resistance(DCR):22mΩ Current Rating:3A Number of Circuits:1; LCSC Part Name: 单路 0402磁珠 阻抗33Ω@100MHz; Supplier Part: C160974; Manufacturer: muRata(村田); Supplier Footprint: 0402; JLCPCB Part Class: Extended Part; Datasheet: https://item.szlcsc.com/datasheet/BLM15PX330SN1D/172355.html; Supplier: LCSC; Impedance @ Frequency: 33Ω@100MHz; Tolerance: ±25%; DC Resistance(DCR): 22mΩ; Current Rating: 3A; Number of Circuits: 1
USB1 = 051N-4BH806-S: Supplier Part: C25503148; Manufacturer: HanElectricity(瀚源); Supplier Footprint: SMD; JLCPCB Part Class: Extended Part; Datasheet: https://atta.szlcsc.com/upload/public/pdf/source/20240704/B9ACE647D7515FFB86E3BAE398E1EB22.pdf; Supplier: LCSC; Check: true

## Nets
1.8V_FT: C217.2 C218.1 C219.1 U98.12(VCORE) U98.37(VCORE) U98.49(VREGOUT) U98.64(VCORE)
3.3V: C183.2 C186.1 C213.1 C220.2 C221.1 C222.1 C223.1 C224.1 R211.2 R213.2 R214.2 R218.1 R220.1 R222.1 U93.1 U98.20(VCCIO) U98.31(VCCIO) U98.42(VCCIO) U98.50(VREGIN) U98.56(VCCIO) U102.6(VCC) U103.1 U104.1
3.3V_PHY_JTAG: C214.1 C215.2 U98.4(VPHY) U104.2
3.3V_PLL_JTAG: C188.1 C212.2 U98.9(VPLL) U103.2
GND: C183.1 C184.1 C185.1 C186.2 C188.2 C212.1 C213.2 C214.2 C215.1 C217.1 C218.2 C219.2 C220.1 C221.2 C222.2 C223.2 C224.2 C226.1 D1.2 R181.1 R219.1 U93.7 U93.8 U98.1(GND) U98.5(GND) U98.10(AGND) U98.11(GND) U98.13(TEST) U98.15(GND) U98.25(GND) U98.35(GND) U98.47(GND) U98.51(GND) U101.2(Gnd) U101.4(Gnd) U102.2(VSS) USB1.5(GND) USB1.6(EP) USB1.7(EP) USB1.8(EP) USB1.9(EP)
5_VBUS: C226.2 D1.5 R179.2 USB1.1(VBUS)
FTDI_RST: R218.2 U98.14(RESET#)
P_CCK: U98.16(ADBUS0) U112.1
P_CDI0: U98.17(ADBUS1) U112.3
P_CDI1: U98.18(ADBUS2) U112.5
P_CDI3: U98.23(ADBUS6) U111.5
P_CONDONE: U98.22(ADBUS5) U111.1
P_CRESET_N: U93.5 U98.21(ADBUS4) U111.3
P_SS: U98.19(ADBUS3) U112.7
P_TCK: U93.4 U98.38(BDBUS0) U110.1
P_TDI: U93.3 U98.39(BDBUS1) U110.3
P_TDO: U93.2 U98.40(BDBUS2) U110.5
P_TMS: U93.6 U98.41(BDBUS3) U110.7
T120_CCK: U112.2
T120_CDI0: U112.4
T120_CDI1: U112.6
T120_CDI2: U111.8
T120_CDI3: U111.6
T120_CONDONE: U111.2
T120_CRESET_N: U111.4
T120_SS: U112.8
T120_TCK: U110.2
T120_TDI: U110.4
T120_TDO: U110.6
T120_TMS: U110.8
USB_D_N: D1.3 R215.1 USB1.2(D-)
USB_D_P: D1.1 R217.1 USB1.3(D+)
Net-(C184-2): C184.2 U98.3(OSCO) U101.1(In/Out)
Net-(C185-2): C185.2 U98.2(OSCI) U101.3(Out/In)
Net-(R179-1): R179.1 R181.2 U98.59(BCBUS7)
Net-(R211-1): R211.1 R212.2 U102.1(DO)
Net-(R212-1): R212.1 U98.61(EEDATA) U102.3(DI)
Net-(R213-1): R213.1 U98.63(EECS) U102.5(CS)
Net-(R214-1): R214.1 U98.62(EECLK) U102.4(CLK)
Net-(R215-2): R215.2 U98.7(DM)
Net-(R217-2): R217.2 U98.8(DP)
Net-(R219-2): R219.2 U98.6(REF)
Net-(R220-2): R220.2 U98.53(BCBUS2)
Net-(R222-2): R222.2 U98.28(ACBUS2)

Not connected (* = marked no-connect by the designer): D1 4* 6*; U98 24(ADBUS7)* 26(ACBUS0)* 27(ACBUS1)* 29(ACBUS3)* 30(ACBUS4)* 32(ACBUS5)* 33(ACBUS6)* 34(ACBUS7)* 36(SUSPEND#)* 43(BDBUS4)* 44(BDBUS5)* 45(BDBUS6)* 46(BDBUS7)* 48(BCBUS0)* 52(BCBUS1)* 54(BCBUS3)* 55(BCBUS4)* 57(BCBUS5)* 58(BCBUS6)* 60(PWREN#)*; U111 7*; USB1 4(ID)

## Notes on the sheet
- T120_FPGA JUMPER OPTIONS
- FPGA JTAG_PROGRAMMER

# Schematic MUL_NO_H_CELL_2X_2T1C
Create Date: 2026-06-07; Page Name: P1; Project Name: Inverted_MAML_6x6; Schematic Name: Schematic2; Update Date: 2026-06-07; Company: EasyEDA.com; Drawn: Olle Welin; Page Size: A4; Version: V1.0
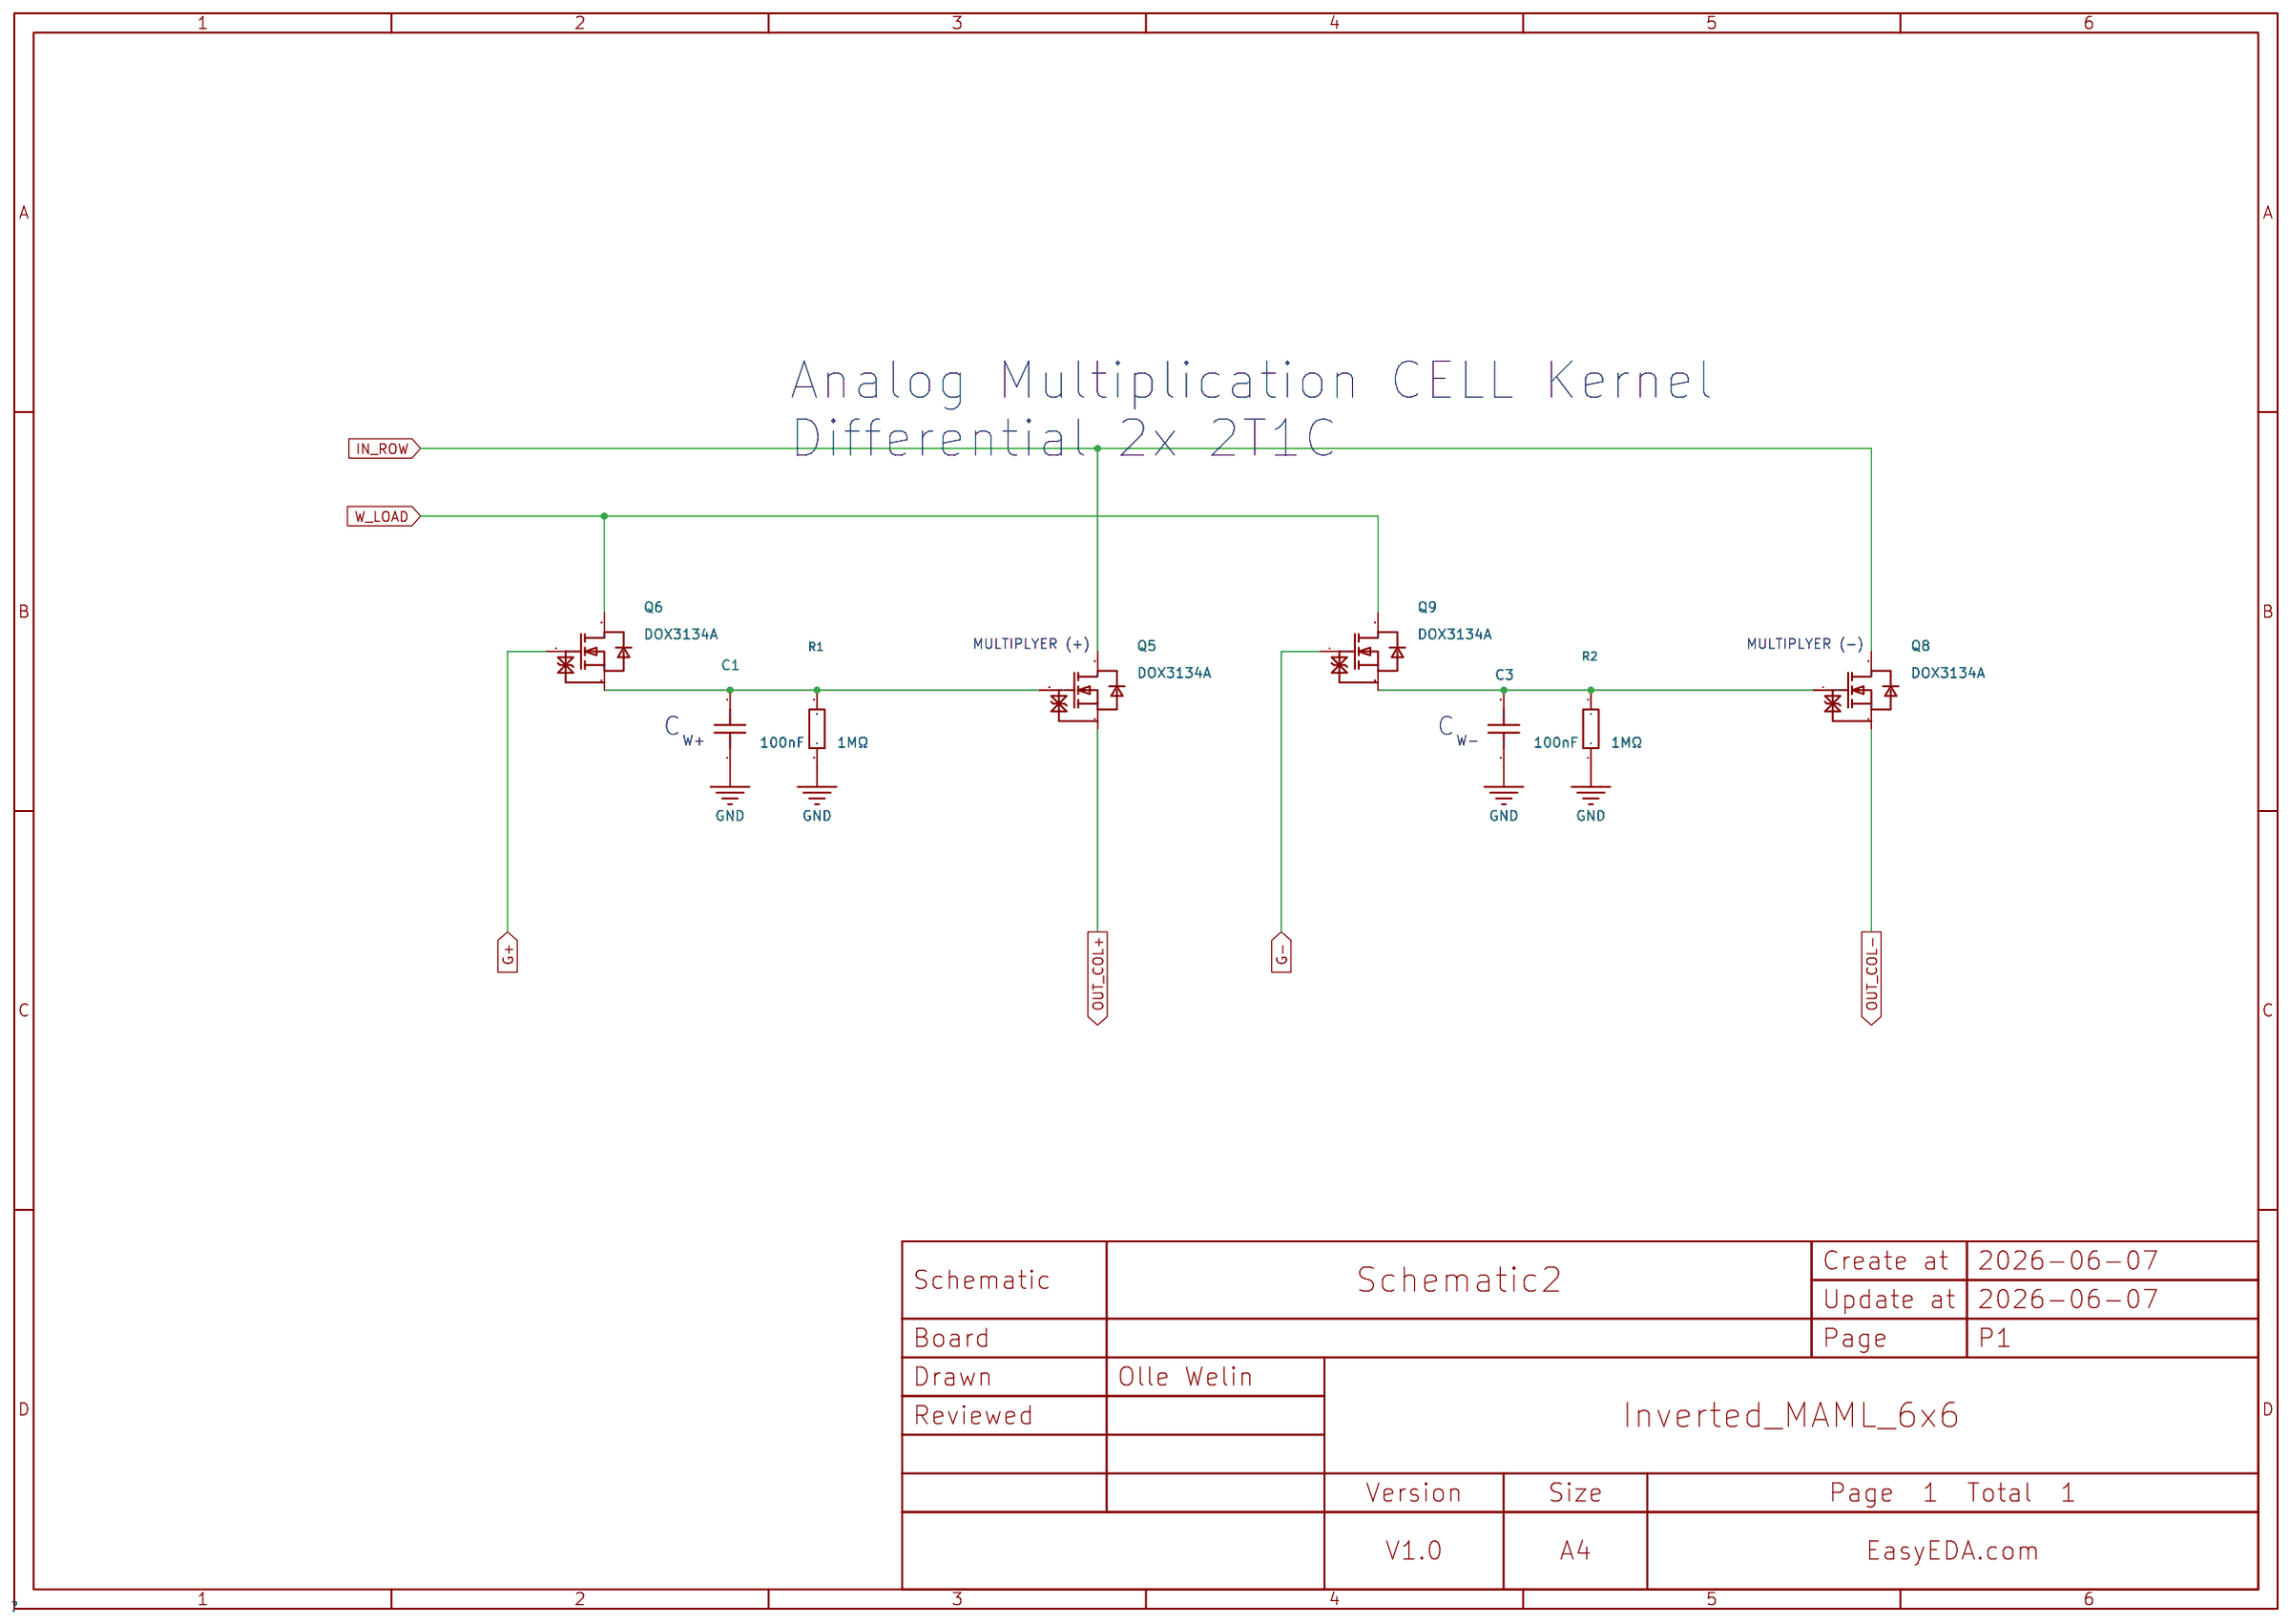
[diagram p4: schematic sheet]

## Parts
C1  100nF  [C0402]
C3  100nF  [C0402]
Q5  DOX3134A  [SOT-323-3_L2.1-W1.3-P1.30-LS2.3-BR]
Q6  DOX3134A  [SOT-323-3_L2.1-W1.3-P1.30-LS2.3-BR]
Q8  DOX3134A  [SOT-323-3_L2.1-W1.3-P1.30-LS2.3-BR]
Q9  DOX3134A  [SOT-323-3_L2.1-W1.3-P1.30-LS2.3-BR]
R1  1MΩ  [R0402]
R2  1MΩ  [R0402]

## Library data of the parts
C1 C3 = CL05B104KO5NNNC: Capacitance:100nF Tolerance:±10% Tolerance:±10% Voltage Rating:16V Temperature Coefficient:X7R; LCSC Part Name: 100nF ±10% 16V; Supplier Part: C1525; Manufacturer: SAMSUNG(三星); Supplier Footprint: 0402; JLCPCB Part Class: Basic Part; Datasheet: https://item.szlcsc.com/datasheet/CL05B104KO5NNNC/1877.html; Supplier: LCSC; Tolerance: ±10%; Voltage Rating: 16V; Temperature Coefficient: X7R
Q5 Q6 Q8 Q9 = DOX3134A: Number:1 N-channel Drain to Source Voltage:20V Current - Continuous Drain(Id):900mA RDS(on):120Ω@4.5V Pd - Power Dissipation:220mW Gate Threshold Voltage (Vgs(th)):600mV Gate Charge(Qg):1nC@4.5V Input Capacitance(Ciss):63pF Reverse Transfer Capacitance (C; Supplier Part: C54349756; Manufacturer: DOINGTER(杜因特); Supplier Footprint: SOT-323; JLCPCB Part Class: Extended Part; Datasheet: https://item.szlcsc.com/datasheet/DOX3134A/57652932.html; Supplier: LCSC; Number: 1 N-channel; Drain to Source Voltage: 20V; Current - Continuous Drain(Id): 900mA; RDS(on): 120Ω@4.5V; Pd - Power Dissipation: 220mW; Gate Threshold Voltage (Vgs(th)): 600mV; Gate Charge(Qg): 1nC@4.5V; Input Capacitance(Ciss): 63pF; Reverse Transfer Capacitance (Crss@Vds): 12pF; Operating Temperature: -50℃~+150℃; Type: N-Channel; Output Capacitance(Coss): 23pF
R1 R2 = 0402WGF1004TCE: Type:Thick Film Resistor Resistance:1MΩ Tolerance:±1% Tolerance:±1% Power(Watts):62.5mW Voltage-Supply(Max):50V Temperature Coefficient:±100ppm/℃ Temperature Coefficient:±100ppm/℃ Operating Temperature:-55℃~+155℃ Operating Temperature:-55℃~+155℃; LCSC Part Name: 1MΩ ±1% 62.5mW 厚膜电阻; Supplier Part: C26083; Manufacturer: UNI-ROYAL(厚声); Supplier Footprint: 0402; JLCPCB Part Class: Basic Part; Datasheet: https://item.szlcsc.com/datasheet/0402WGF1004TCE/26826.html; Supplier: LCSC; Type: Thick Film Resistor; Tolerance: ±1%; Power(Watts): 62.5mW; Voltage-Supply(Max): 50V; Temperature Coefficient: ±100ppm/℃; Operating Temperature: -55℃~+155℃

## Nets
GND: C1.1 C3.1 R1.1 R2.1
G+: Q6.1(G)
G-: Q9.1(G)
IN_ROW: Q5.3(D) Q8.3(D)
OUT_COL+: Q5.2(S)
OUT_COL-: Q8.2(S)
W_LOAD: Q6.3(D) Q9.3(D)
Net-(C1-2): C1.2 Q5.1(G) Q6.2(S) R1.2
Net-(C3-2): C3.2 Q8.1(G) Q9.2(S) R2.2

## Notes on the sheet
- Analog Multiplication CELL Kernel
  Differential 2x 2T1C
- MULTIPLYER (+)
- MULTIPLYER (-)
- C
- W+
- C
- W-

# Schematic Atomic_triad
Create Date: 2026-06-20; Page Name: P1; Project Name: Inverted_MAML_6x6; Schematic Name: Schematic1; Update Date: 2026-06-20; Company: EasyEDA.com; Page Size: A4; Version: V1.0
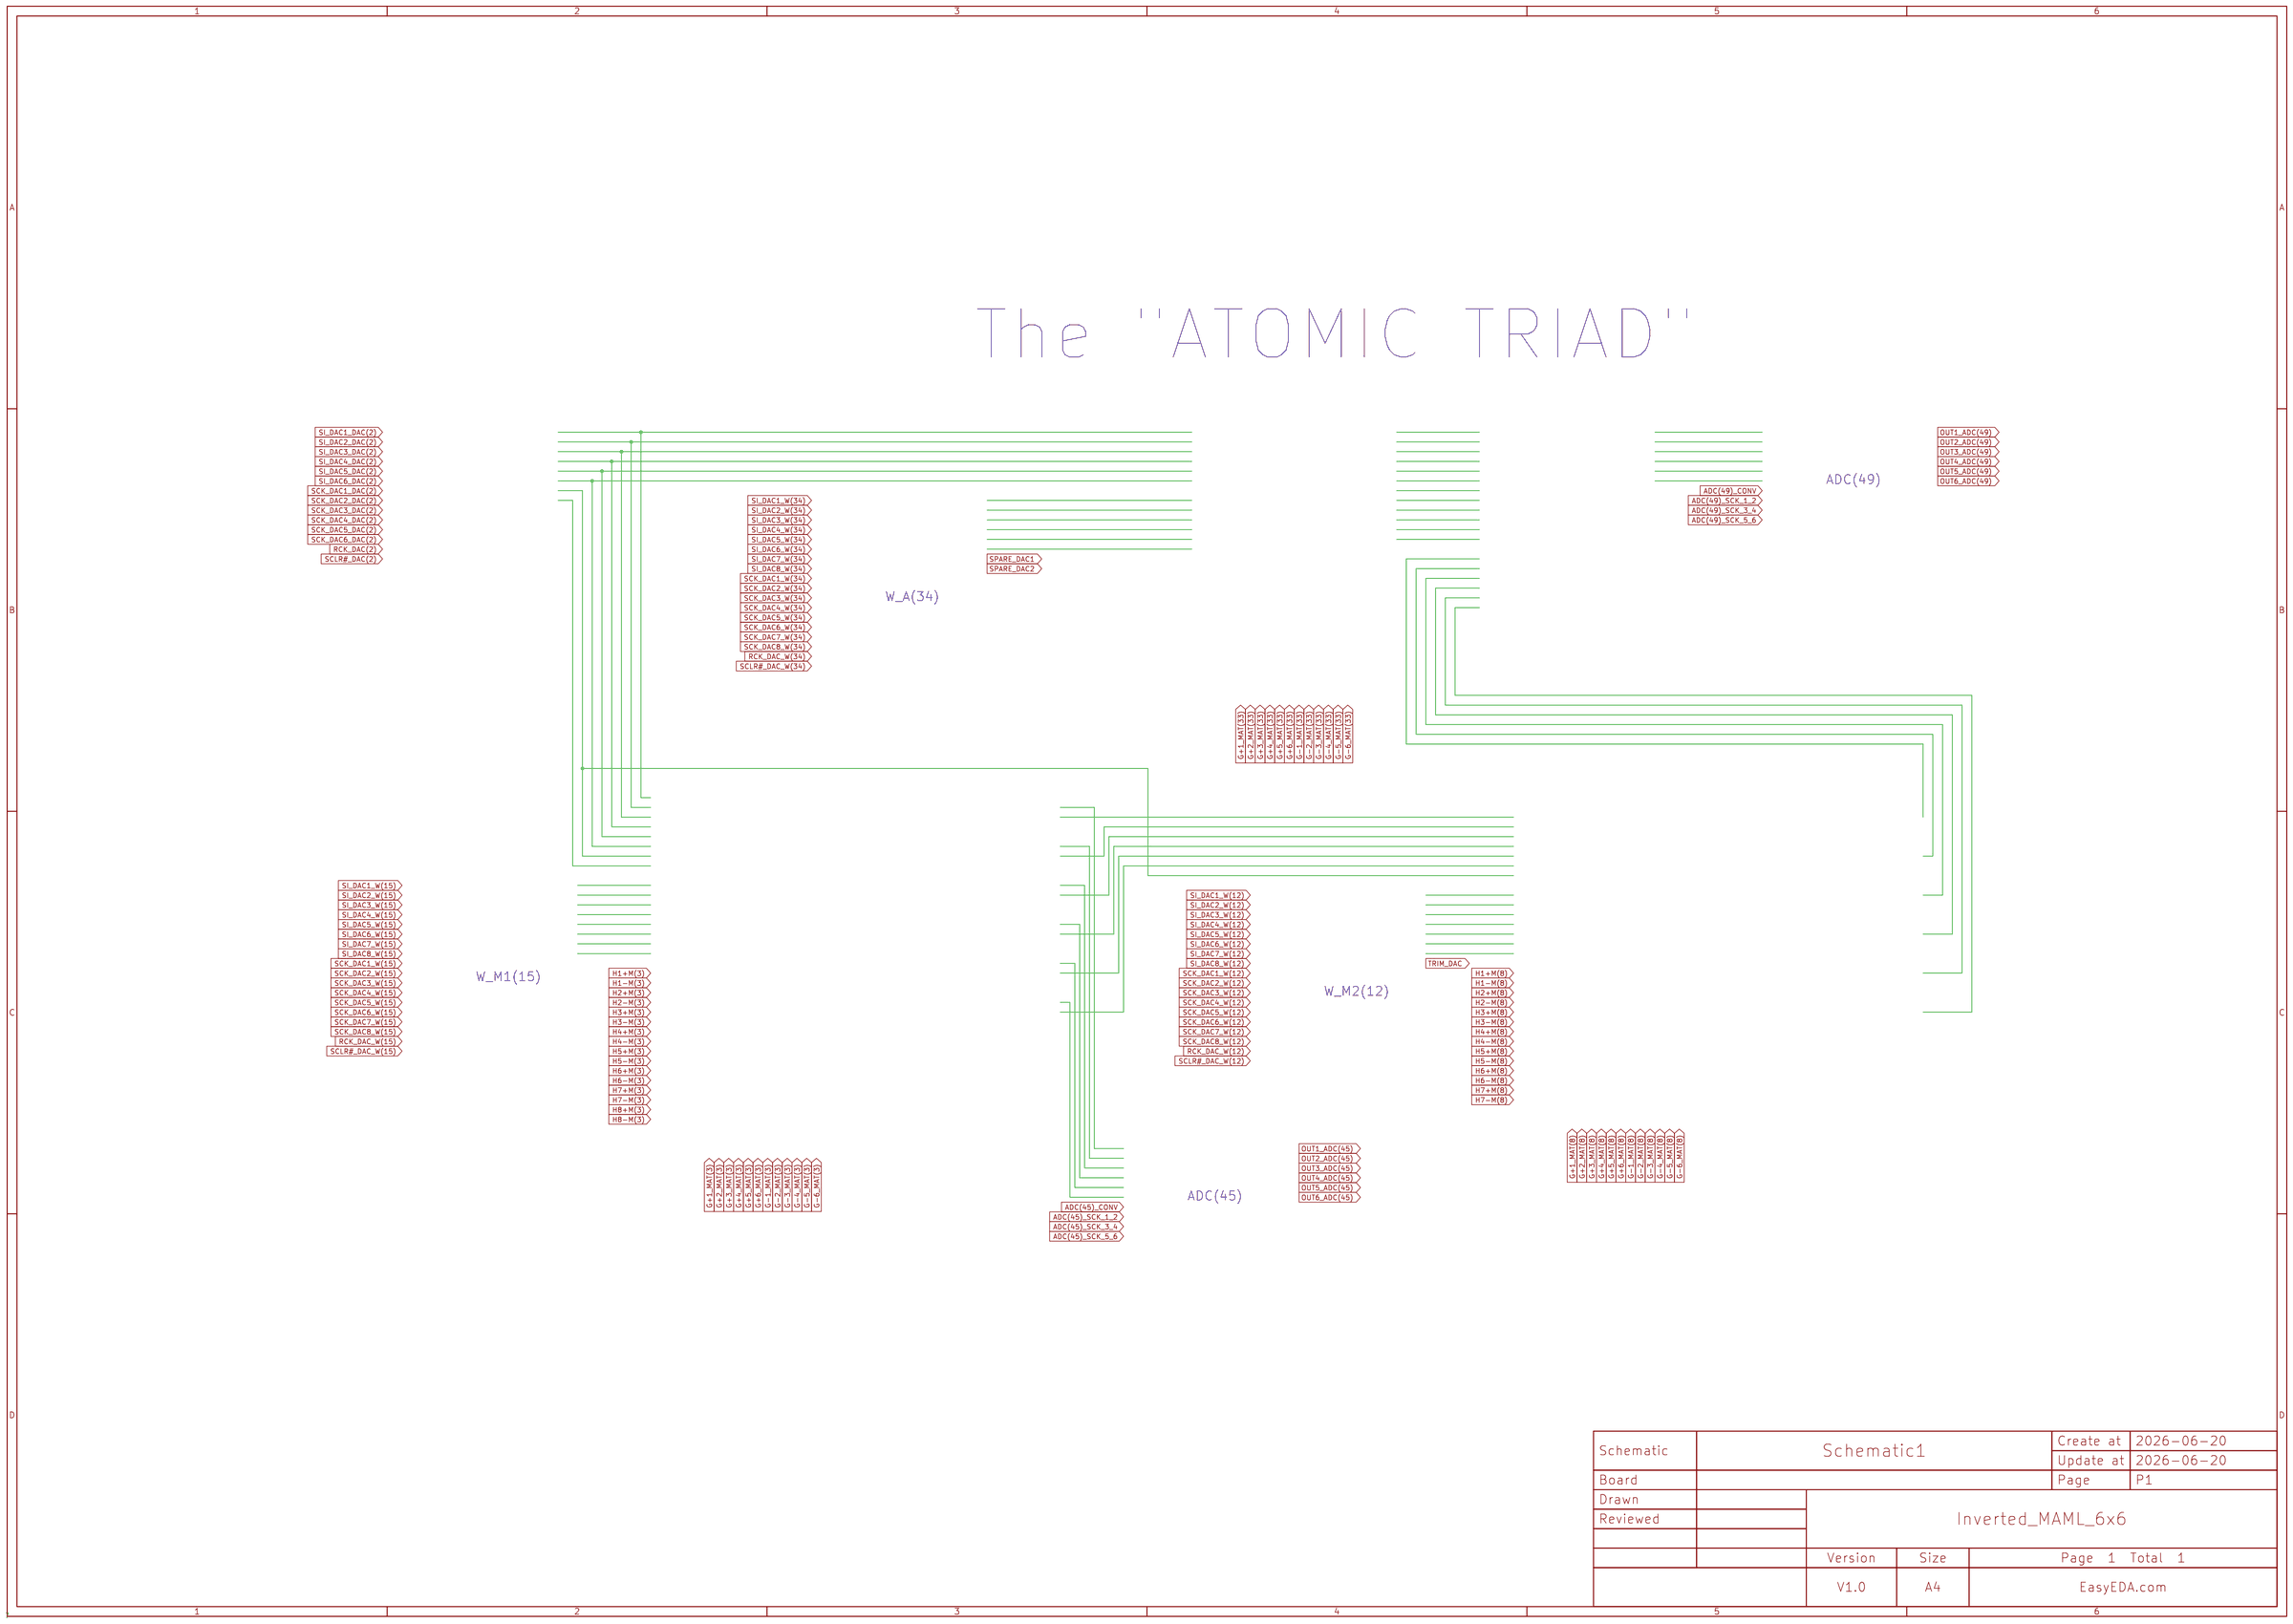
[diagram p5: schematic sheet]

## Parts
CBB1  -
CBB2  -
CBB3  -
CBB4  -
CBB5  -
CBB6  -
CBB7  -
CBB8  -
CBB9  -
CBB10  -
CBB11  -
CBB12  -
CBB13  -
CBB14  -
CBB15  -
CBB16  -
CBB17  -
CBB18  -
CBB19  -
CBB20  -
CBB21  -
CBB49  -

## Nets
ADC(45)_CONV: CBB1.(SIG_OUT_Y) CBB2.(SIG_OUT_Y) CBB3.(SIG_OUT_Y) CBB4.(SIG_OUT_Y) CBB5.(SIG_OUT_Y) CBB6.(SIG_OUT_Y) CBB7.(SCK_5_6) CBB8.(SIG_OUT_Y) CBB9.(IN_BIAS_ROW7) CBB10.(SIG_OUT_Y) CBB11.(SIG_OUT_Y) CBB12.(SIG_OUT_Y) CBB13.(SIG_OUT_Y) CBB14.(SIG_OUT_Y) CBB15.(SUM_6) CBB16.(TRIM_REF) CBB17.(DAC_W_ROW8) CBB18.(DAC_W_ROW8) CBB19.(COL-TIA6) CBB20.(DAC_W_ROW8) CBB21.(SCK_5_6) CBB49.(IN_REF_ROW8)

## Notes on the sheet
- The "ATOMIC TRIAD"
- ADC(49)
- W_A(34)
- W_M1(15)
- W_M2(12)
- ADC(45)

# Schematic SUM35
Create Date: 2026-06-14; Page Name: P1; Project Name: Inverted_MAML_6x6; Schematic Name: Schematic1; Update Date: 2026-06-14; Company: EasyEDA.com; Drawn: Olle Welin; Page Size: A4; Version: V1.0
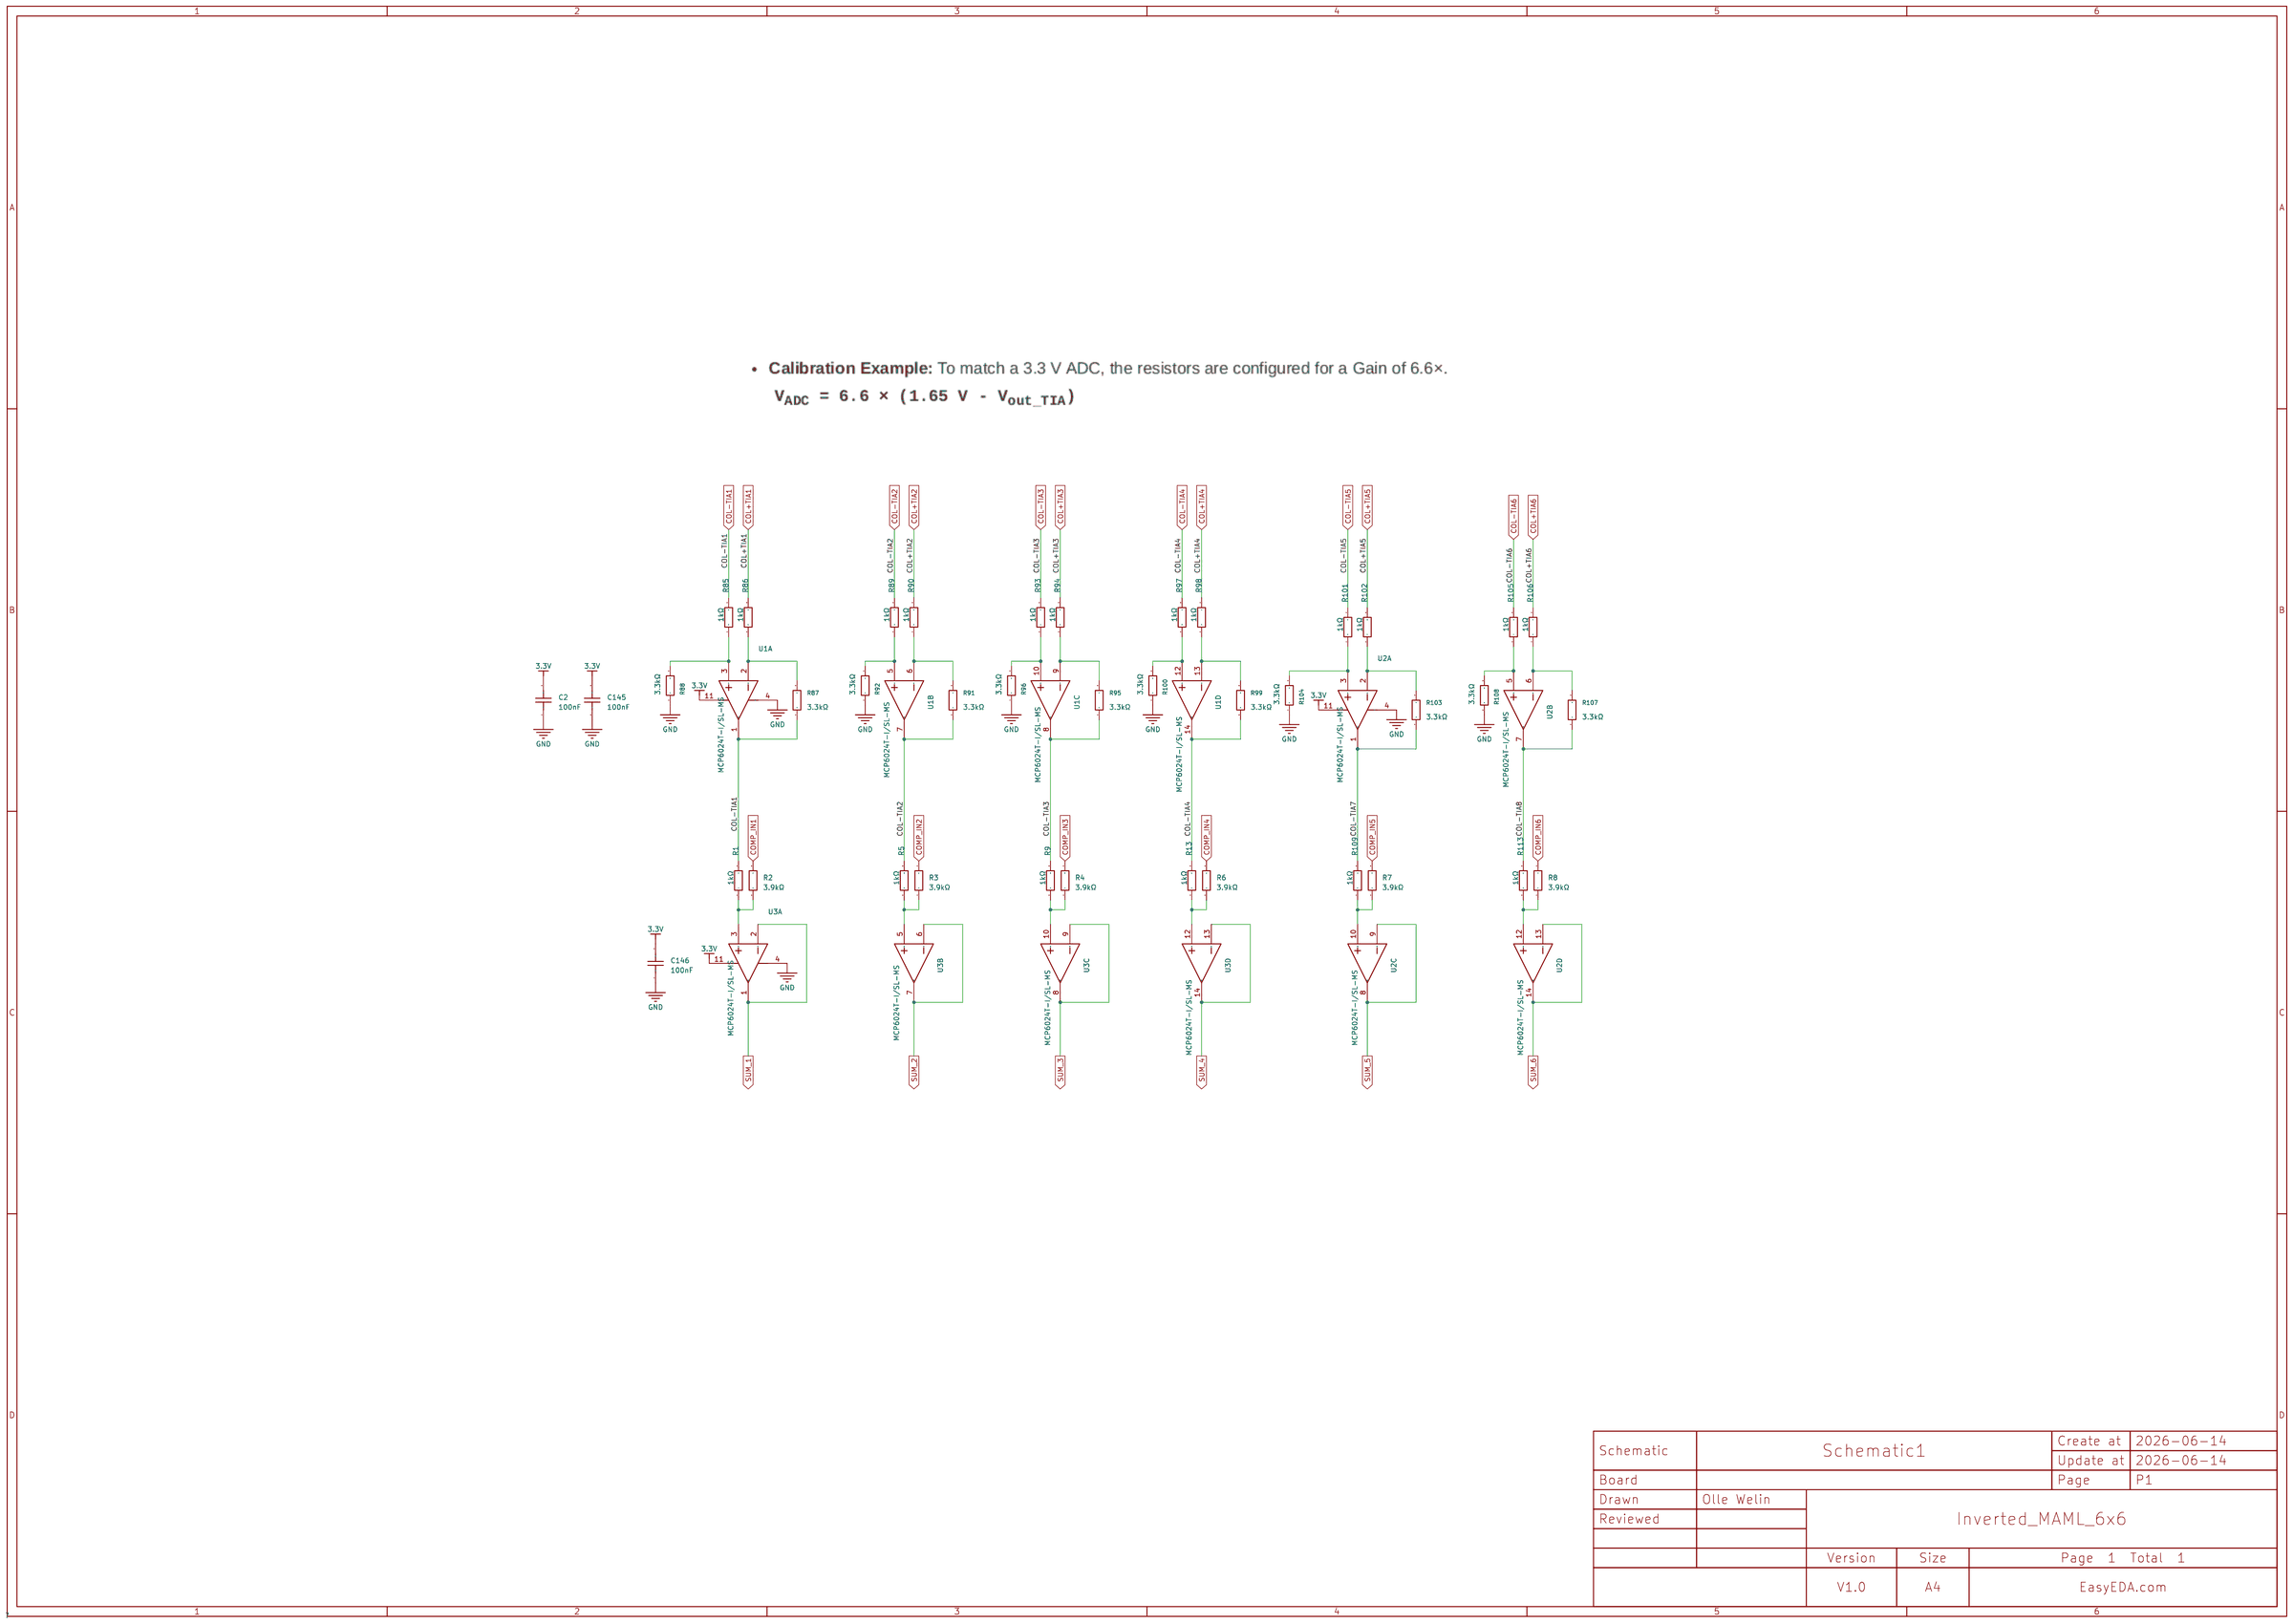
[diagram p6: schematic sheet]

## Parts
C2  100nF  [C0402]
C145  100nF  [C0402]
C146  100nF  [C0402]
R1  1kΩ  [R0402]
R2  3.9kΩ  [R0402]
R3  3.9kΩ  [R0402]
R4  3.9kΩ  [R0402]
R5  1kΩ  [R0402]
R6  3.9kΩ  [R0402]
R7  3.9kΩ  [R0402]
R8  3.9kΩ  [R0402]
R9  1kΩ  [R0402]
R13  1kΩ  [R0402]
R85  1kΩ  [R0402]
R86  1kΩ  [R0402]
R87  3.3kΩ  [R0402]
R88  3.3kΩ  [R0402]
R89  1kΩ  [R0402]
R90  1kΩ  [R0402]
R91  3.3kΩ  [R0402]
R92  3.3kΩ  [R0402]
R93  1kΩ  [R0402]
R94  1kΩ  [R0402]
R95  3.3kΩ  [R0402]
R96  3.3kΩ  [R0402]
R97  1kΩ  [R0402]
R98  1kΩ  [R0402]
R99  3.3kΩ  [R0402]
R100  3.3kΩ  [R0402]
R101  1kΩ  [R0402]
R102  1kΩ  [R0402]
R103  3.3kΩ  [R0402]
R104  3.3kΩ  [R0402]
R105  1kΩ  [R0402]
R106  1kΩ  [R0402]
R107  3.3kΩ  [R0402]
R108  3.3kΩ  [R0402]
R109  1kΩ  [R0402]
R113  1kΩ  [R0402]
U1  MCP6024T-I/SL-MS  [SOIC-14_L8.7-W3.9-P1.27-LS6.0-BL-1]  (sections 1,2,3,4)
U2  MCP6024T-I/SL-MS  [SOIC-14_L8.7-W3.9-P1.27-LS6.0-BL-1]  (sections 1,2,3,4)
U3  MCP6024T-I/SL-MS  [SOIC-14_L8.7-W3.9-P1.27-LS6.0-BL-1]  (sections 1,2,3,4)

## Library data of the parts
C2 C145 C146 = CL05B104KO5NNNC: Capacitance:100nF Tolerance:±10% Tolerance:±10% Voltage Rating:16V Temperature Coefficient:X7R; LCSC Part Name: 100nF ±10% 16V; Supplier Part: C1525; Manufacturer: SAMSUNG(三星); Supplier Footprint: 0402; JLCPCB Part Class: Basic Part; Datasheet: https://item.szlcsc.com/datasheet/CL05B104KO5NNNC/1877.html; Supplier: LCSC; Tolerance: ±10%; Voltage Rating: 16V; Temperature Coefficient: X7R
R1 R5 R9 R13 R85 R86 R89 R90 R93 R94 R97 R98 R101 R102 R105 R106 R109 R113 = 0402WGF1001TCE: Type:Thick Film Resistor Resistance:1kΩ Tolerance:±1% Tolerance:±1% Power(Watts):62.5mW Voltage-Supply(Max):50V Temperature Coefficient:±100ppm/℃ Temperature Coefficient:±100ppm/℃ Operating Temperature:-55℃~+155℃ Operating Temperature:-55℃~+155℃; LCSC Part Name: 1kΩ ±1% 62.5mW 厚膜电阻; Supplier Part: C11702; Manufacturer: UNI-ROYAL(厚声); Supplier Footprint: 0402; JLCPCB Part Class: Basic Part; Datasheet: https://item.szlcsc.com/datasheet/0402WGF1001TCE/12256.html; Supplier: LCSC; Type: Thick Film Resistor; Tolerance: ±1%; Power(Watts): 62.5mW; Voltage-Supply(Max): 50V; Temperature Coefficient: ±100ppm/℃; Operating Temperature: -55℃~+155℃
R2-R4 R6-R8 = 0402WGF3901TCE: Type:Thick Film Resistor Resistance:3.9kΩ Tolerance:±1% Tolerance:±1% Power(Watts):62.5mW Voltage-Supply(Max):50V Temperature Coefficient:±100ppm/℃ Temperature Coefficient:±100ppm/℃ Operating Temperature:-55℃~+155℃ Operating Temperature:-55℃~+155℃; LCSC Part Name: 3.9kΩ ±1% 62.5mW 厚膜电阻; Supplier Part: C51721; Manufacturer: UNI-ROYAL(厚声); Supplier Footprint: 0402; JLCPCB Part Class: Extended Part; Datasheet: https://item.szlcsc.com/datasheet/0402WGF3901TCE/52734.html; Supplier: LCSC; Type: Thick Film Resistor; Tolerance: ±1%; Power(Watts): 62.5mW; Voltage-Supply(Max): 50V; Temperature Coefficient: ±100ppm/℃; Operating Temperature: -55℃~+155℃
R87 R88 R91 R92 R95 R96 R99 R100 R103 R104 R107 R108 = 0402WGF3301TCE: Type:Thick Film Resistor Resistance:3.3kΩ Tolerance:±1% Tolerance:±1% Power(Watts):62.5mW Voltage-Supply(Max):50V Temperature Coefficient:±100ppm/℃ Temperature Coefficient:±100ppm/℃ Operating Temperature:-55℃~+155℃ Operating Temperature:-55℃~+155℃; LCSC Part Name: 3.3kΩ ±1% 62.5mW 厚膜电阻; Supplier Part: C25890; Manufacturer: UNI-ROYAL(厚声); Supplier Footprint: 0402; JLCPCB Part Class: Basic Part; Datasheet: https://item.szlcsc.com/datasheet/0402WGF3301TCE/26633.html; Supplier: LCSC; Type: Thick Film Resistor; Tolerance: ±1%; Power(Watts): 62.5mW; Voltage-Supply(Max): 50V; Temperature Coefficient: ±100ppm/℃; Operating Temperature: -55℃~+155℃
U1-U3 = MCP6024T-I/SL-MS: Supplier Part: C54539958; Manufacturer: MSKSEMI(美森科); Supplier Footprint: SOP-14; JLCPCB Part Class: Extended Part; Datasheet: https://item.szlcsc.com/datasheet/MCP6024T-I%252FSL-MS/57895720.html; Supplier: LCSC

## Nets
3.3V: C2.2 C145.2 C146.2 U1.11(V-) U2.11(V-) U3.11(V-)
GND: C2.1 C145.1 C146.1 R88.1 R92.1 R96.1 R100.1 R104.1 R108.1 U1.4(V+) U2.4(V+) U3.4(V+)
COL+TIA1: R86.2
COL+TIA2: R90.2
COL+TIA3: R94.2
COL+TIA4: R98.2
COL+TIA5: R102.2
COL+TIA6: R106.2
COL-TIA1: R1.2 R85.2 R87.1 U1.1(OUT1)
COL-TIA2: R5.2 R89.2 R91.1 U1.7(OUT2)
COL-TIA3: R9.2 R93.2 R95.1 U1.8(OUT3)
COL-TIA4: R13.2 R97.2 R99.1 U1.14(OUT4)
COL-TIA5: R101.2
COL-TIA6: R105.2
COL-TIA7: R103.1 R109.2 U2.1(OUT1)
COL-TIA8: R107.1 R113.2 U2.7(OUT2)
COMP_IN1: R2.2
COMP_IN2: R3.2
COMP_IN3: R4.2
COMP_IN4: R6.2
COMP_IN5: R7.2
COMP_IN6: R8.2
SUM_1: U3.1(OUT1) U3.2(IN1-)
SUM_2: U3.6(IN2-) U3.7(OUT2)
SUM_3: U3.8(OUT3) U3.9(IN3-)
SUM_4: U3.13(IN4-) U3.14(OUT4)
SUM_5: U2.8(OUT3) U2.9(IN3-)
SUM_6: U2.13(IN4-) U2.14(OUT4)
Net-(R1-1): R1.1 R2.1 U3.3(IN1+)
Net-(R3-1): R3.1 R5.1 U3.5(IN2+)
Net-(R4-1): R4.1 R9.1 U3.10(IN3+)
Net-(R6-1): R6.1 R13.1 U3.12(IN4+)
Net-(R7-1): R7.1 R109.1 U2.10(IN3+)
Net-(R8-1): R8.1 R113.1 U2.12(IN4+)
Net-(R85-1): R85.1 R88.2 U1.3(IN1+)
Net-(R86-1): R86.1 R87.2 U1.2(IN1-)
Net-(R89-1): R89.1 R92.2 U1.5(IN2+)
Net-(R90-1): R90.1 R91.2 U1.6(IN2-)
Net-(R93-1): R93.1 R96.2 U1.10(IN3+)
Net-(R94-1): R94.1 R95.2 U1.9(IN3-)
Net-(R97-1): R97.1 R100.2 U1.12(IN4+)
Net-(R98-1): R98.1 R99.2 U1.13(IN4-)
Net-(R101-1): R101.1 R104.2 U2.3(IN1+)
Net-(R102-1): R102.1 R103.2 U2.2(IN1-)
Net-(R105-1): R105.1 R108.2 U2.5(IN2+)
Net-(R106-1): R106.1 R107.2 U2.6(IN2-)

# Schematic 8xDAC_WEIGHT
Create Date: 2026-06-15; Page Name: P1; Project Name: Inverted_MAML_6x6; Schematic Name: Schematic1; Update Date: 2026-06-15; Company: EasyEDA.com; Drawn: Olle Welin; Page Size: A4; Version: V1.0
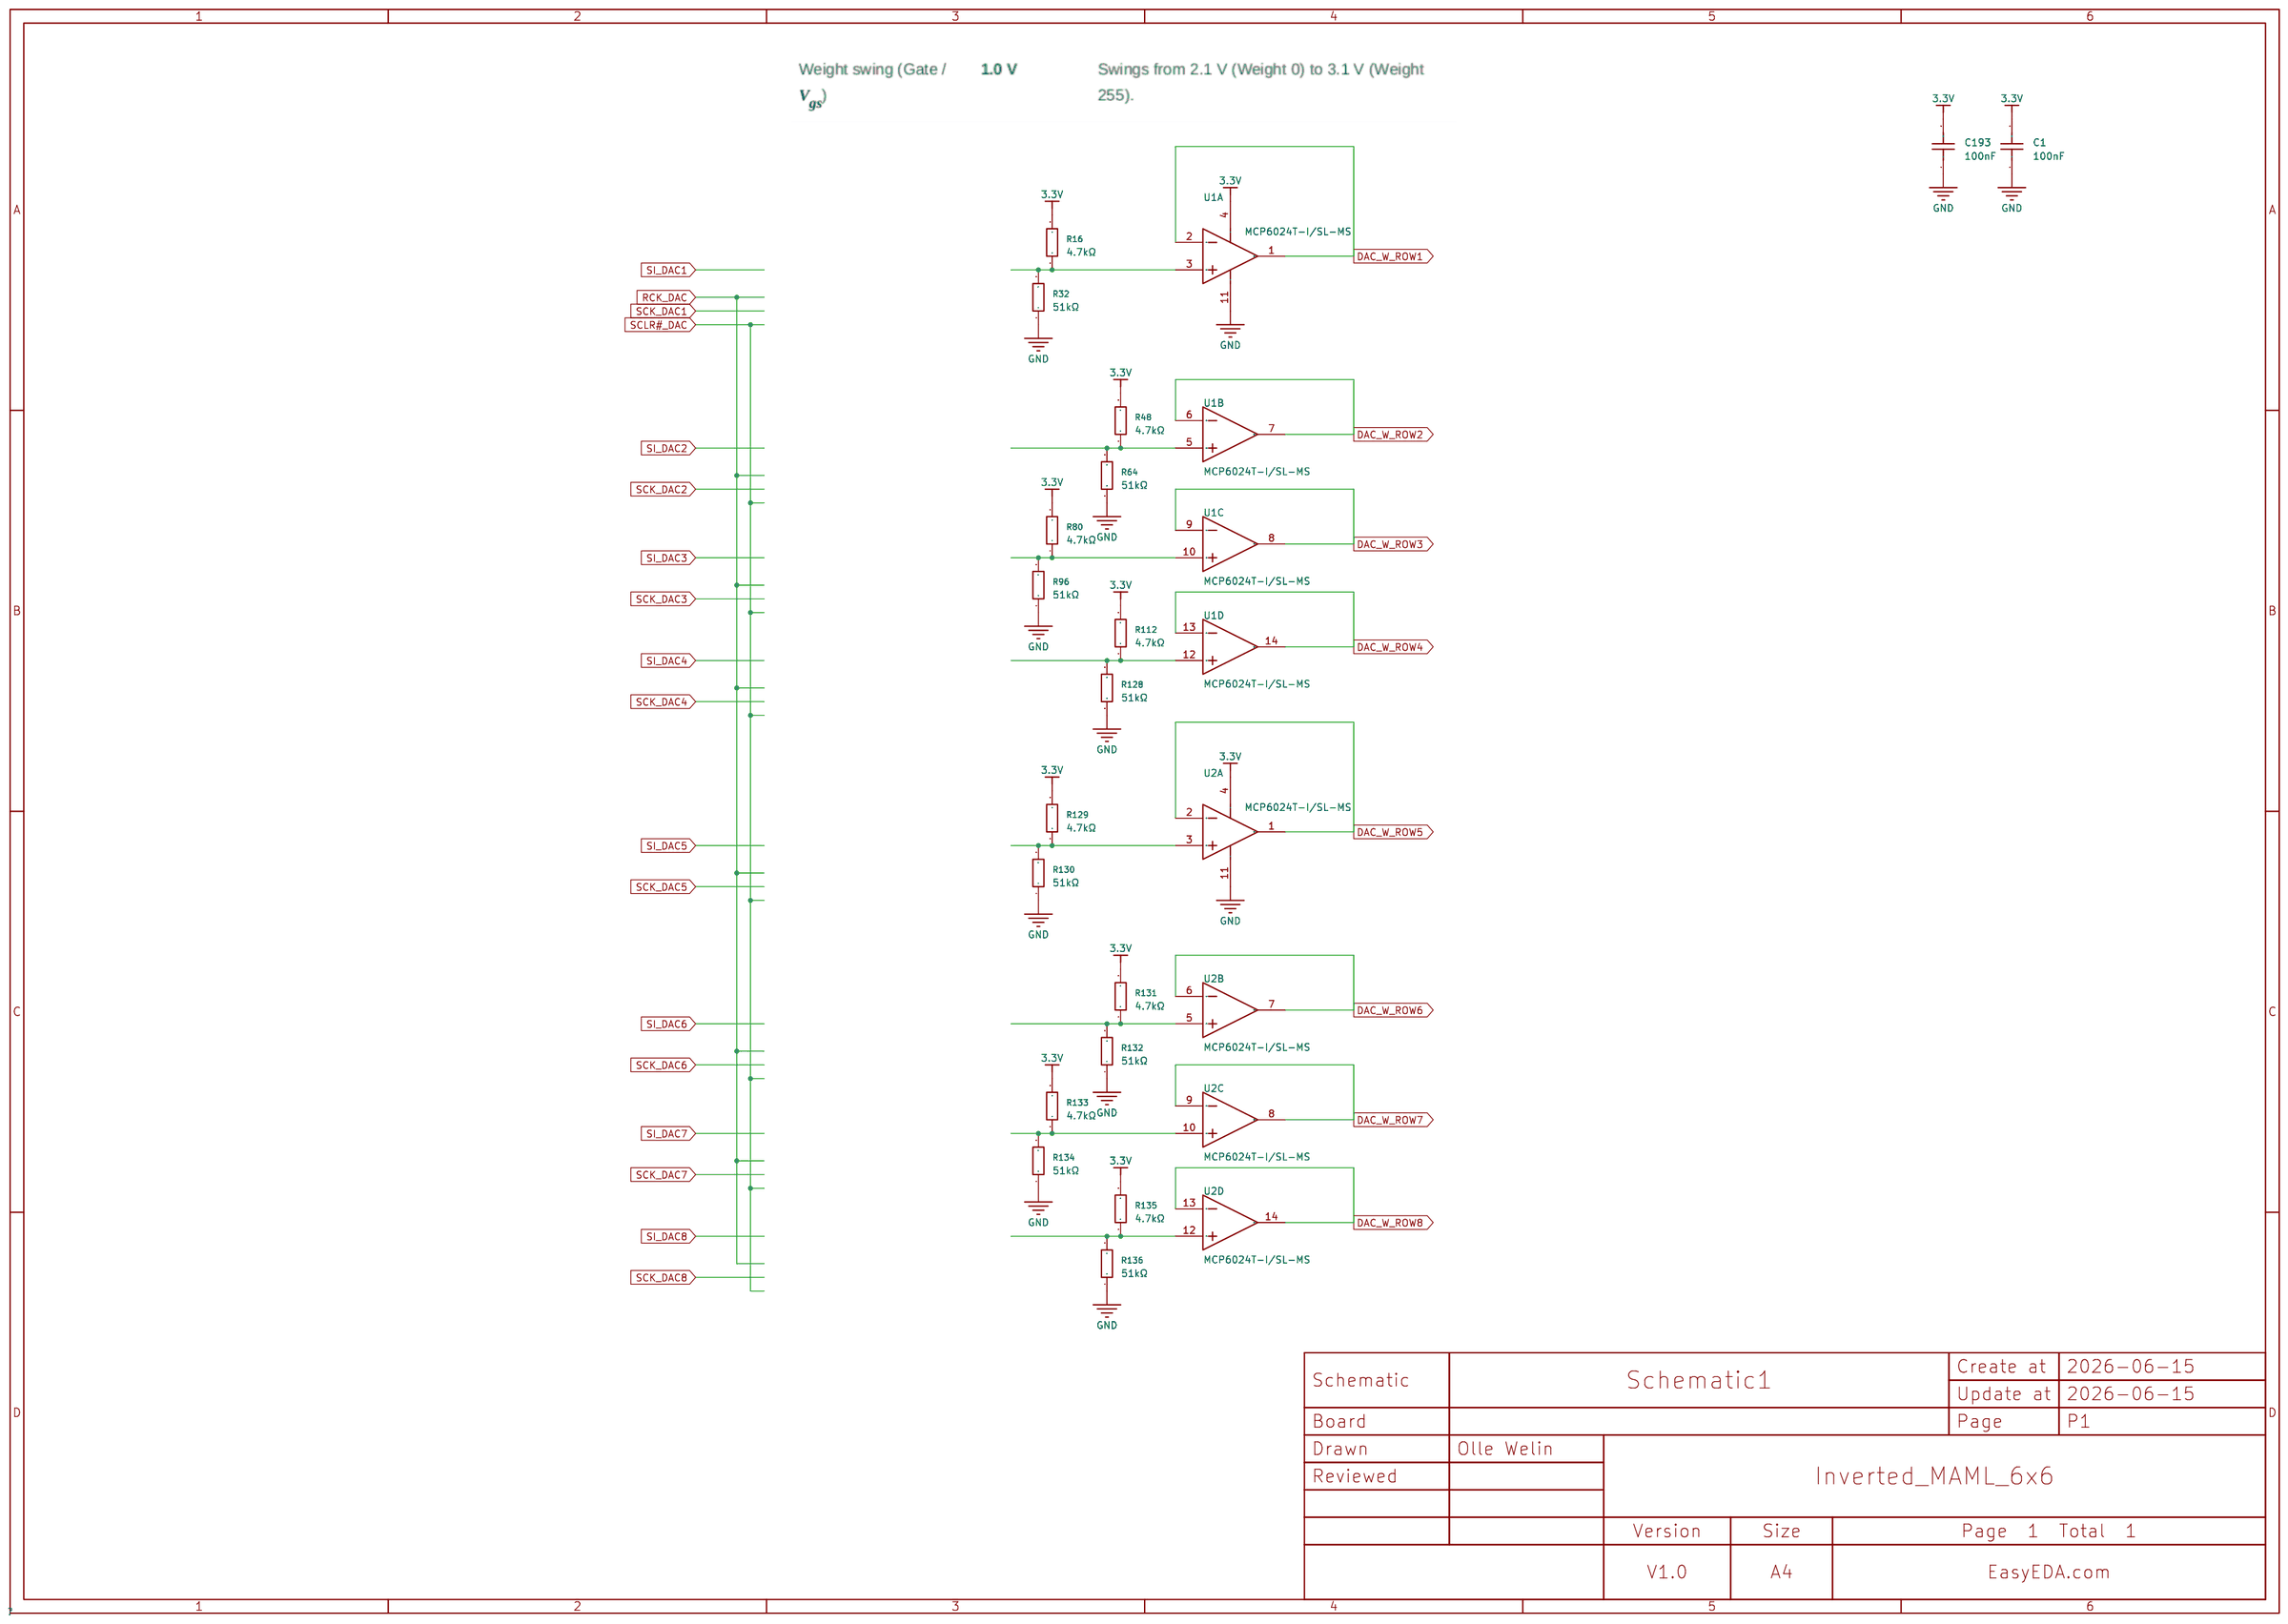
[diagram p7: schematic sheet]

## Parts
C1  100nF  [C0402]
C193  100nF  [C0402]
CBB1  -
CBB2  -
CBB3  -
CBB4  -
CBB5  -
CBB6  -
CBB7  -
CBB8  -
R16  4.7kΩ  [R0402]
R32  51kΩ  [R0402]
R48  4.7kΩ  [R0402]
R64  51kΩ  [R0402]
R80  4.7kΩ  [R0402]
R96  51kΩ  [R0402]
R112  4.7kΩ  [R0402]
R128  51kΩ  [R0402]
R129  4.7kΩ  [R0402]
R130  51kΩ  [R0402]
R131  4.7kΩ  [R0402]
R132  51kΩ  [R0402]
R133  4.7kΩ  [R0402]
R134  51kΩ  [R0402]
R135  4.7kΩ  [R0402]
R136  51kΩ  [R0402]
U1  MCP6024T-I/SL-MS  [SOIC-14_L8.7-W3.9-P1.27-LS6.0-BL-1]  (sections 1,2,3,4)
U2  MCP6024T-I/SL-MS  [SOIC-14_L8.7-W3.9-P1.27-LS6.0-BL-1]  (sections 1,2,3,4)

## Library data of the parts
C1 C193 = CL05B104KO5NNNC: Capacitance:100nF Tolerance:±10% Tolerance:±10% Voltage Rating:16V Temperature Coefficient:X7R; LCSC Part Name: 100nF ±10% 16V; Supplier Part: C1525; Manufacturer: SAMSUNG(三星); Supplier Footprint: 0402; JLCPCB Part Class: Basic Part; Datasheet: https://item.szlcsc.com/datasheet/CL05B104KO5NNNC/1877.html; Supplier: LCSC; Tolerance: ±10%; Voltage Rating: 16V; Temperature Coefficient: X7R
R16 R48 R80 R112 R129 R131 R133 R135 = 0402WGF4701TCE: Type:Thick Film Resistor Resistance:4.7kΩ Tolerance:±1% Tolerance:±1% Power(Watts):62.5mW Voltage-Supply(Max):50V Temperature Coefficient:±100ppm/℃ Temperature Coefficient:±100ppm/℃ Operating Temperature:-55℃~+155℃ Operating Temperature:-55℃~+155℃; LCSC Part Name: 4.7kΩ ±1% 62.5mW 厚膜电阻; Supplier Part: C25900; Manufacturer: UNI-ROYAL(厚声); Supplier Footprint: 0402; JLCPCB Part Class: Basic Part; Datasheet: https://item.szlcsc.com/datasheet/0402WGF4701TCE/26643.html; Supplier: LCSC; Type: Thick Film Resistor; Tolerance: ±1%; Power(Watts): 62.5mW; Voltage-Supply(Max): 50V; Temperature Coefficient: ±100ppm/℃; Operating Temperature: -55℃~+155℃
R32 R64 R96 R128 R130 R132 R134 R136 = 0402WGF5102TCE: Type:Thick Film Resistors Resistance:51kΩ Tolerance:±1% Tolerance:±1% Power(Watts): Overload Voltage (Max): Temperature Coefficient:±100ppm/℃ Temperature Coefficient:±100ppm/℃ Operating Temperature Range:-55℃~+155℃ Operating Temperature Range:-55℃~+155℃; LCSC Part Name: 51kΩ ±1% 62.5mW 厚膜电阻; Supplier Part: C25794; Manufacturer: UNI-ROYAL(厚声); Supplier Footprint: 0402; JLCPCB Part Class: Basic Part; Datasheet: https://atta.szlcsc.com/upload/public/pdf/source/20200306/C422600_1E6D84923E4A46A82E41ADD87F860B5C.pdf; Supplier: LCSC; Type: Thick Film Resistors; Tolerance: ±1%; Temperature Coefficient: ±100ppm/℃; Operating Temperature Range: -55℃~+155℃
U1 U2 = MCP6024T-I/SL-MS: Supplier Part: C54539958; Manufacturer: MSKSEMI(美森科); Supplier Footprint: SOP-14; JLCPCB Part Class: Extended Part; Datasheet: https://item.szlcsc.com/datasheet/MCP6024T-I%252FSL-MS/57895720.html; Supplier: LCSC

## Nets
3.3V: C1.2 C193.2 R16.2 R48.2 R80.2 R112.2 R129.2 R131.2 R133.2 R135.2 U1.4(V+) U2.4(V+)
GND: C1.1 C193.1 R32.1 R64.1 R96.1 R128.1 R130.1 R132.1 R134.1 R136.1 U1.11(V-) U2.11(V-)
DAC_W_ROW1: U1.1(OUT1) U1.2(IN1-)
DAC_W_ROW2: U1.6(IN2-) U1.7(OUT2)
DAC_W_ROW3: U1.8(OUT3) U1.9(IN3-)
DAC_W_ROW4: U1.13(IN4-) U1.14(OUT4)
DAC_W_ROW5: U2.1(OUT1) U2.2(IN1-)
DAC_W_ROW6: U2.6(IN2-) U2.7(OUT2)
DAC_W_ROW7: U2.8(OUT3) U2.9(IN3-)
DAC_W_ROW8: U2.13(IN4-) U2.14(OUT4)
RCK_DAC: CBB1.(DAC_LAD_OUT) CBB2.(DAC_LAD_OUT) CBB3.(DAC_LAD_OUT) CBB4.(DAC_LAD_OUT) CBB5.(DAC_LAD_OUT) CBB6.(DAC_LAD_OUT) CBB7.(DAC_LAD_OUT) CBB8.(DAC_LAD_OUT) R16.1 R32.2 R48.1 R64.2 R80.1 R96.2 R112.1 R128.2 R129.1 R130.2 R131.1 R132.2 R133.1 R134.2 R135.1 R136.2 U1.3(IN1+) U1.5(IN2+) U1.10(IN3+) U1.12(IN4+) U2.3(IN1+) U2.5(IN2+) U2.10(IN3+) U2.12(IN4+)

# Schematic DAC_8BIT
Create Date: 2026-06-15; Page Name: P1; Project Name: Inverted_MAML_6x6; Schematic Name: Schematic1; Update Date: 2026-06-15; Company: EasyEDA.com; Drawn: Olle Welin; Page Size: A4; Version: V1.0
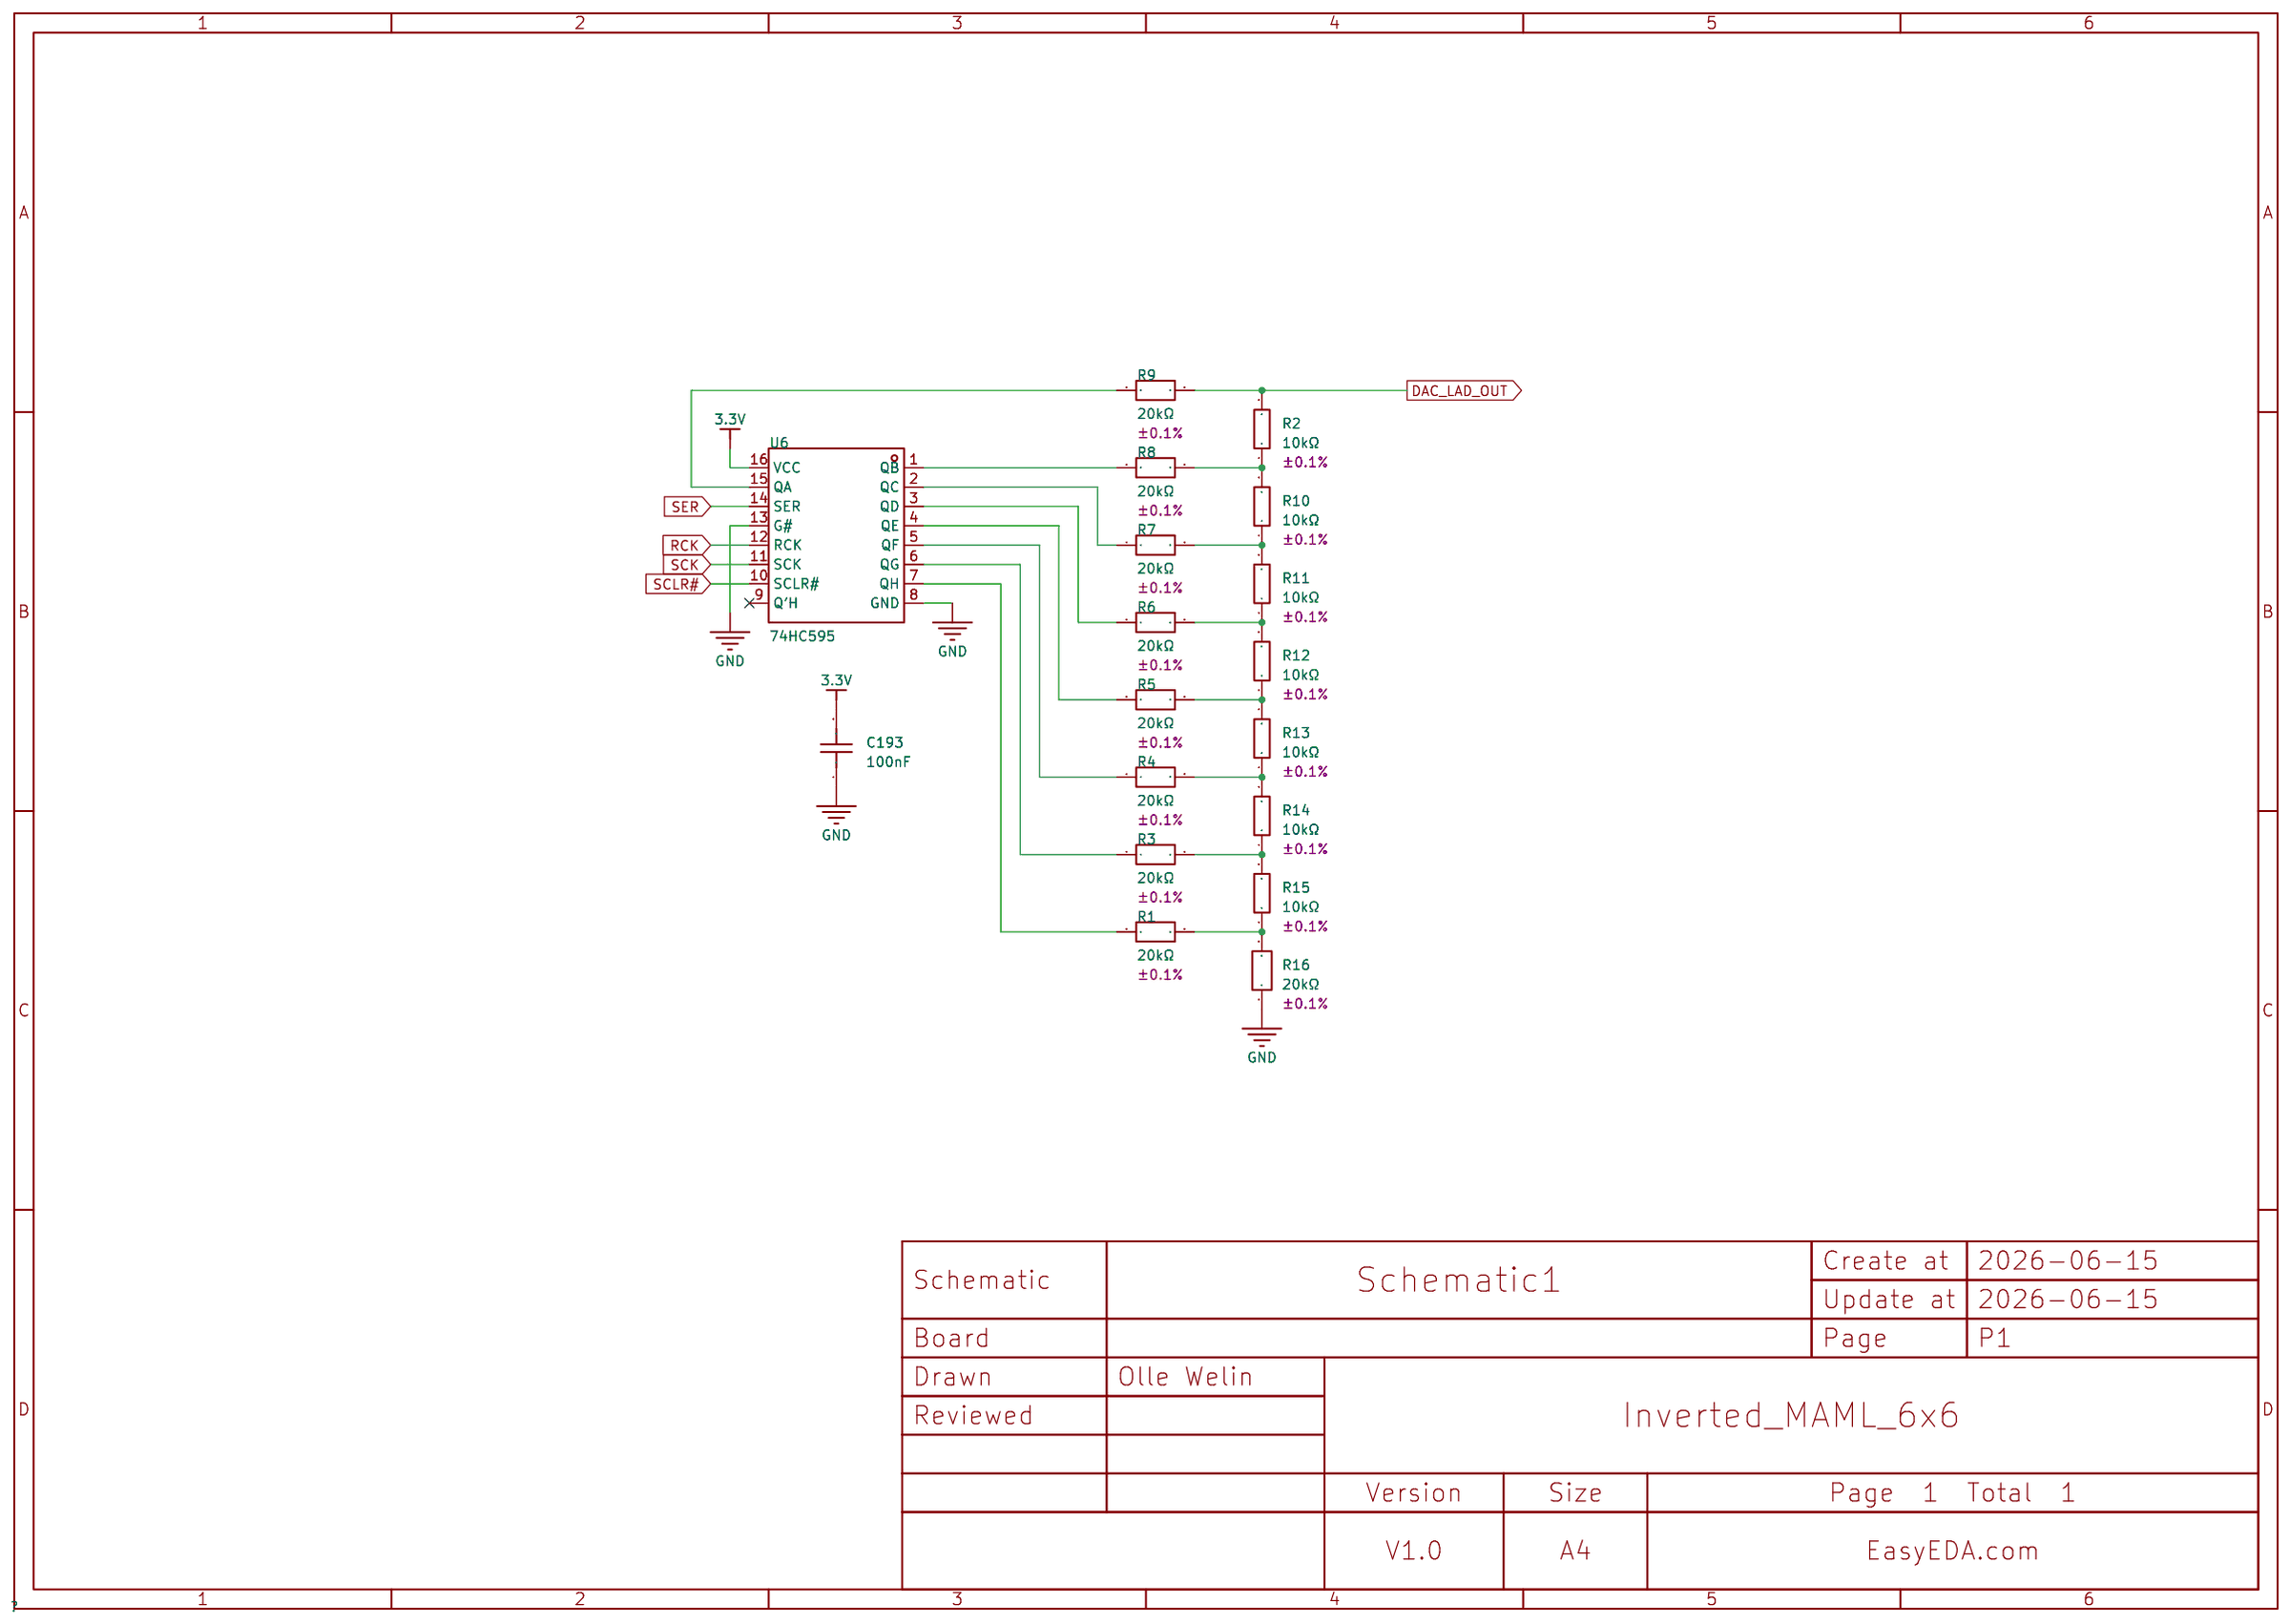
[diagram p8: schematic sheet]

## Parts
C193  100nF  [C0402]
R1  20kΩ  [R0402]
R2  10kΩ  [R0402]
R3  20kΩ  [R0402]
R4  20kΩ  [R0402]
R5  20kΩ  [R0402]
R6  20kΩ  [R0402]
R7  20kΩ  [R0402]
R8  20kΩ  [R0402]
R9  20kΩ  [R0402]
R10  10kΩ  [R0402]
R11  10kΩ  [R0402]
R12  10kΩ  [R0402]
R13  10kΩ  [R0402]
R14  10kΩ  [R0402]
R15  10kΩ  [R0402]
R16  20kΩ  [R0402]
U6  74HC595  [SOP-16_L9.9-W3.9-P1.27-LS6.0-BL]

## Library data of the parts
C193 = CL05B104KO5NNNC: Capacitance:100nF Tolerance:±10% Tolerance:±10% Voltage Rating:16V Temperature Coefficient:X7R; LCSC Part Name: 100nF ±10% 16V; Supplier Part: C1525; Manufacturer: SAMSUNG(三星); Supplier Footprint: 0402; JLCPCB Part Class: Basic Part; Datasheet: https://item.szlcsc.com/datasheet/CL05B104KO5NNNC/1877.html; Supplier: LCSC; Tolerance: ±10%; Voltage Rating: 16V; Temperature Coefficient: X7R
R1 R3-R9 R16 = ARG02BTC2002: Type:Thin Film Resistor Resistance:20kΩ Tolerance:±0.1% Tolerance:±0.1% Power(Watts):62.5mW Voltage-Supply(Max):50V Temperature Coefficient:±25ppm/℃ Temperature Coefficient:±25ppm/℃ Operating Temperature:-55℃~+155℃ Operating Temperature:-55℃~+155℃; LCSC Part Name: 薄膜电阻 20kΩ ±0.1% 62.5mW; Supplier Part: C2984413; Manufacturer: Viking(光颉); Supplier Footprint: 0402; JLCPCB Part Class: Extended Part; Datasheet: https://item.szlcsc.com/datasheet/ARG02BTC2002/3425948.html; Supplier: LCSC; Type: Thin Film Resistor; Tolerance: ±0.1%; Power(Watts): 62.5mW; Voltage-Supply(Max): 50V; Temperature Coefficient: ±25ppm/℃; Operating Temperature: -55℃~+155℃
R2 R10-R15 = RT0402BRD0710KL: Type:Thin Film Resistor Resistance:10kΩ Tolerance:±0.1% Tolerance:±0.1% Power(Watts):62.5mW Voltage-Supply(Max):50V Temperature Coefficient:±25ppm/℃ Temperature Coefficient:±25ppm/℃ Operating Temperature:-55℃~+155℃ Operating Temperature:-55℃~+155℃; LCSC Part Name: 薄膜电阻 10kΩ ±0.1% 62.5mW; Supplier Part: C190095; Manufacturer: YAGEO(国巨); Supplier Footprint: 0402; JLCPCB Part Class: Extended Part; Datasheet: https://item.szlcsc.com/datasheet/RT0402BRD0710KL/208478.html; Supplier: LCSC; Type: Thin Film Resistor; Tolerance: ±0.1%; Power(Watts): 62.5mW; Voltage-Supply(Max): 50V; Temperature Coefficient: ±25ppm/℃; Operating Temperature: -55℃~+155℃
U6 = 74HC595: Function:Serial-to-Serial or Parallel Voltage - Supply:2V~6V Voltage - Supply:2V~6V Clock Frequency:10MHz Number of Elements:1 Number of Bits per Element:8 Output Type:Tri-State Series:74HC Operating Temperature:-40℃~+85℃ Operating Temperature:-40℃~+85℃ P; LCSC Part Name: 8位CMOS移位寄存器; Supplier Part: C18164493; Manufacturer: GR(国睿); Supplier Footprint: SOP-16; Datasheet: https://item.szlcsc.com/datasheet/74HC595/19305556.html; Supplier: LCSC; Function: Serial-to-Serial or Parallel; Voltage - Supply: 2V~6V; Clock Frequency: 10MHz; Number of Elements: 1; Number of Bits per Element: 8; Output Type: Tri-State; Series: 74HC; Operating Temperature: -40℃~+85℃; Propagation Delay: 100ns@5V,50pF

## Nets
3.3V: C193.2 U6.16(VCC)
GND: C193.1 R16.1 U6.8(GND) U6.13(G#)
DAC_LAD_OUT: R2.2 R9.2
RCK: U6.12(RCK)
SCK: U6.11(SCK)
SCLR#: U6.10(SCLR#)
SER: U6.14(SER)
Net-(R1-1): R1.1 U6.7(QH)
Net-(R1-2): R1.2 R15.1 R16.2
Net-(R2-1): R2.1 R8.2 R10.2
Net-(R3-1): R3.1 U6.6(QG)
Net-(R3-2): R3.2 R14.1 R15.2
Net-(R4-1): R4.1 U6.5(QF)
Net-(R4-2): R4.2 R13.1 R14.2
Net-(R5-1): R5.1 U6.4(QE)
Net-(R5-2): R5.2 R12.1 R13.2
Net-(R6-1): R6.1 U6.3(QD)
Net-(R6-2): R6.2 R11.1 R12.2
Net-(R7-1): R7.1 U6.2(QC)
Net-(R7-2): R7.2 R10.1 R11.2
Net-(R8-1): R8.1 U6.1(QB)
Net-(R9-1): R9.1 U6.15(QA)

Not connected (* = marked no-connect by the designer): U6 9(Q′H)*
